# EAGLE board debugger_board (EAGLE 6.6.0), part 1 of 9
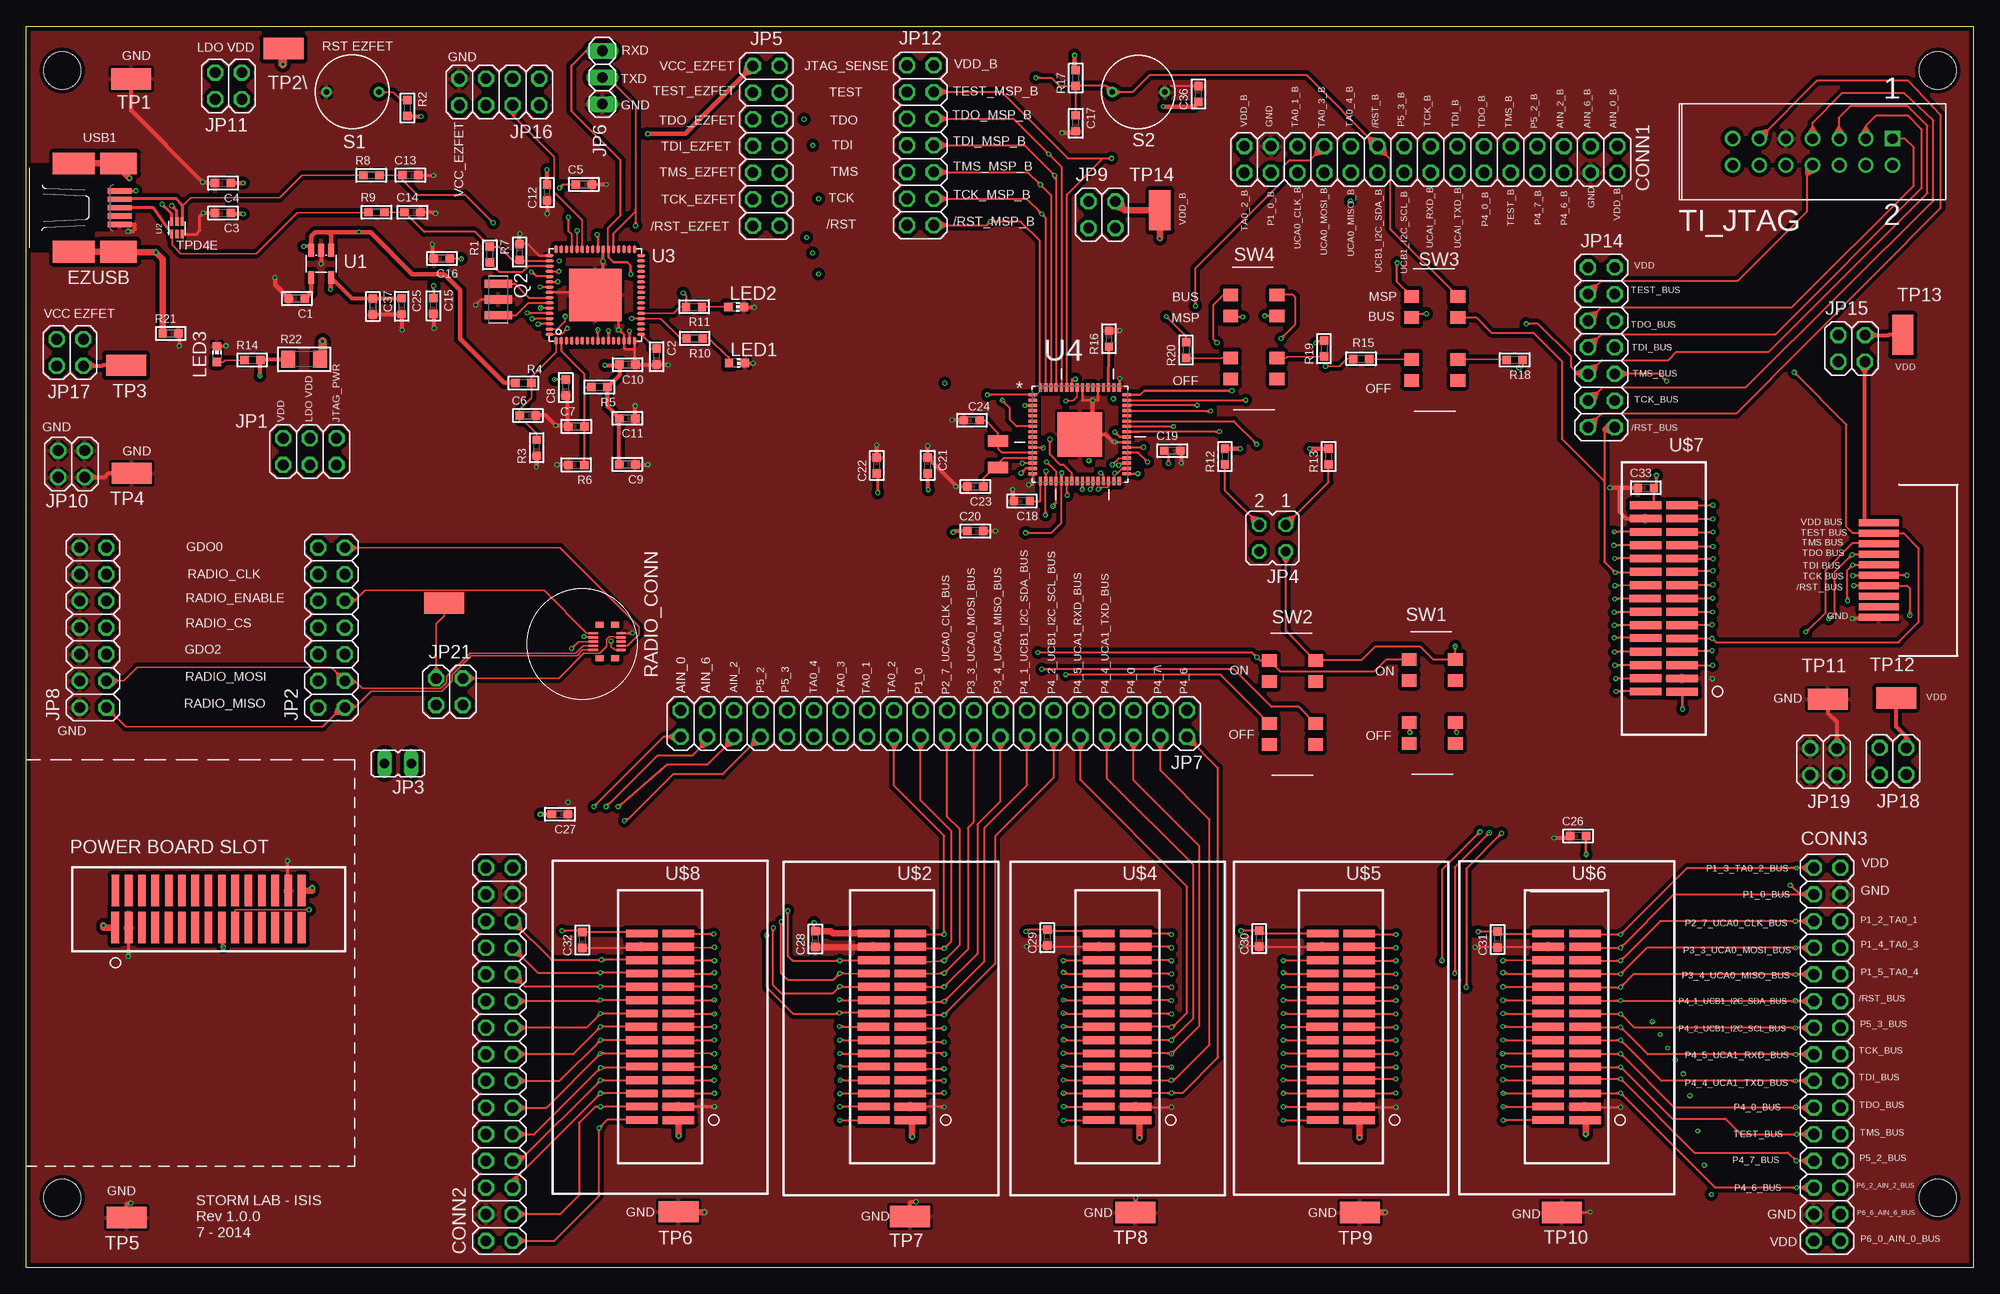
[diagram p5: board, top side]
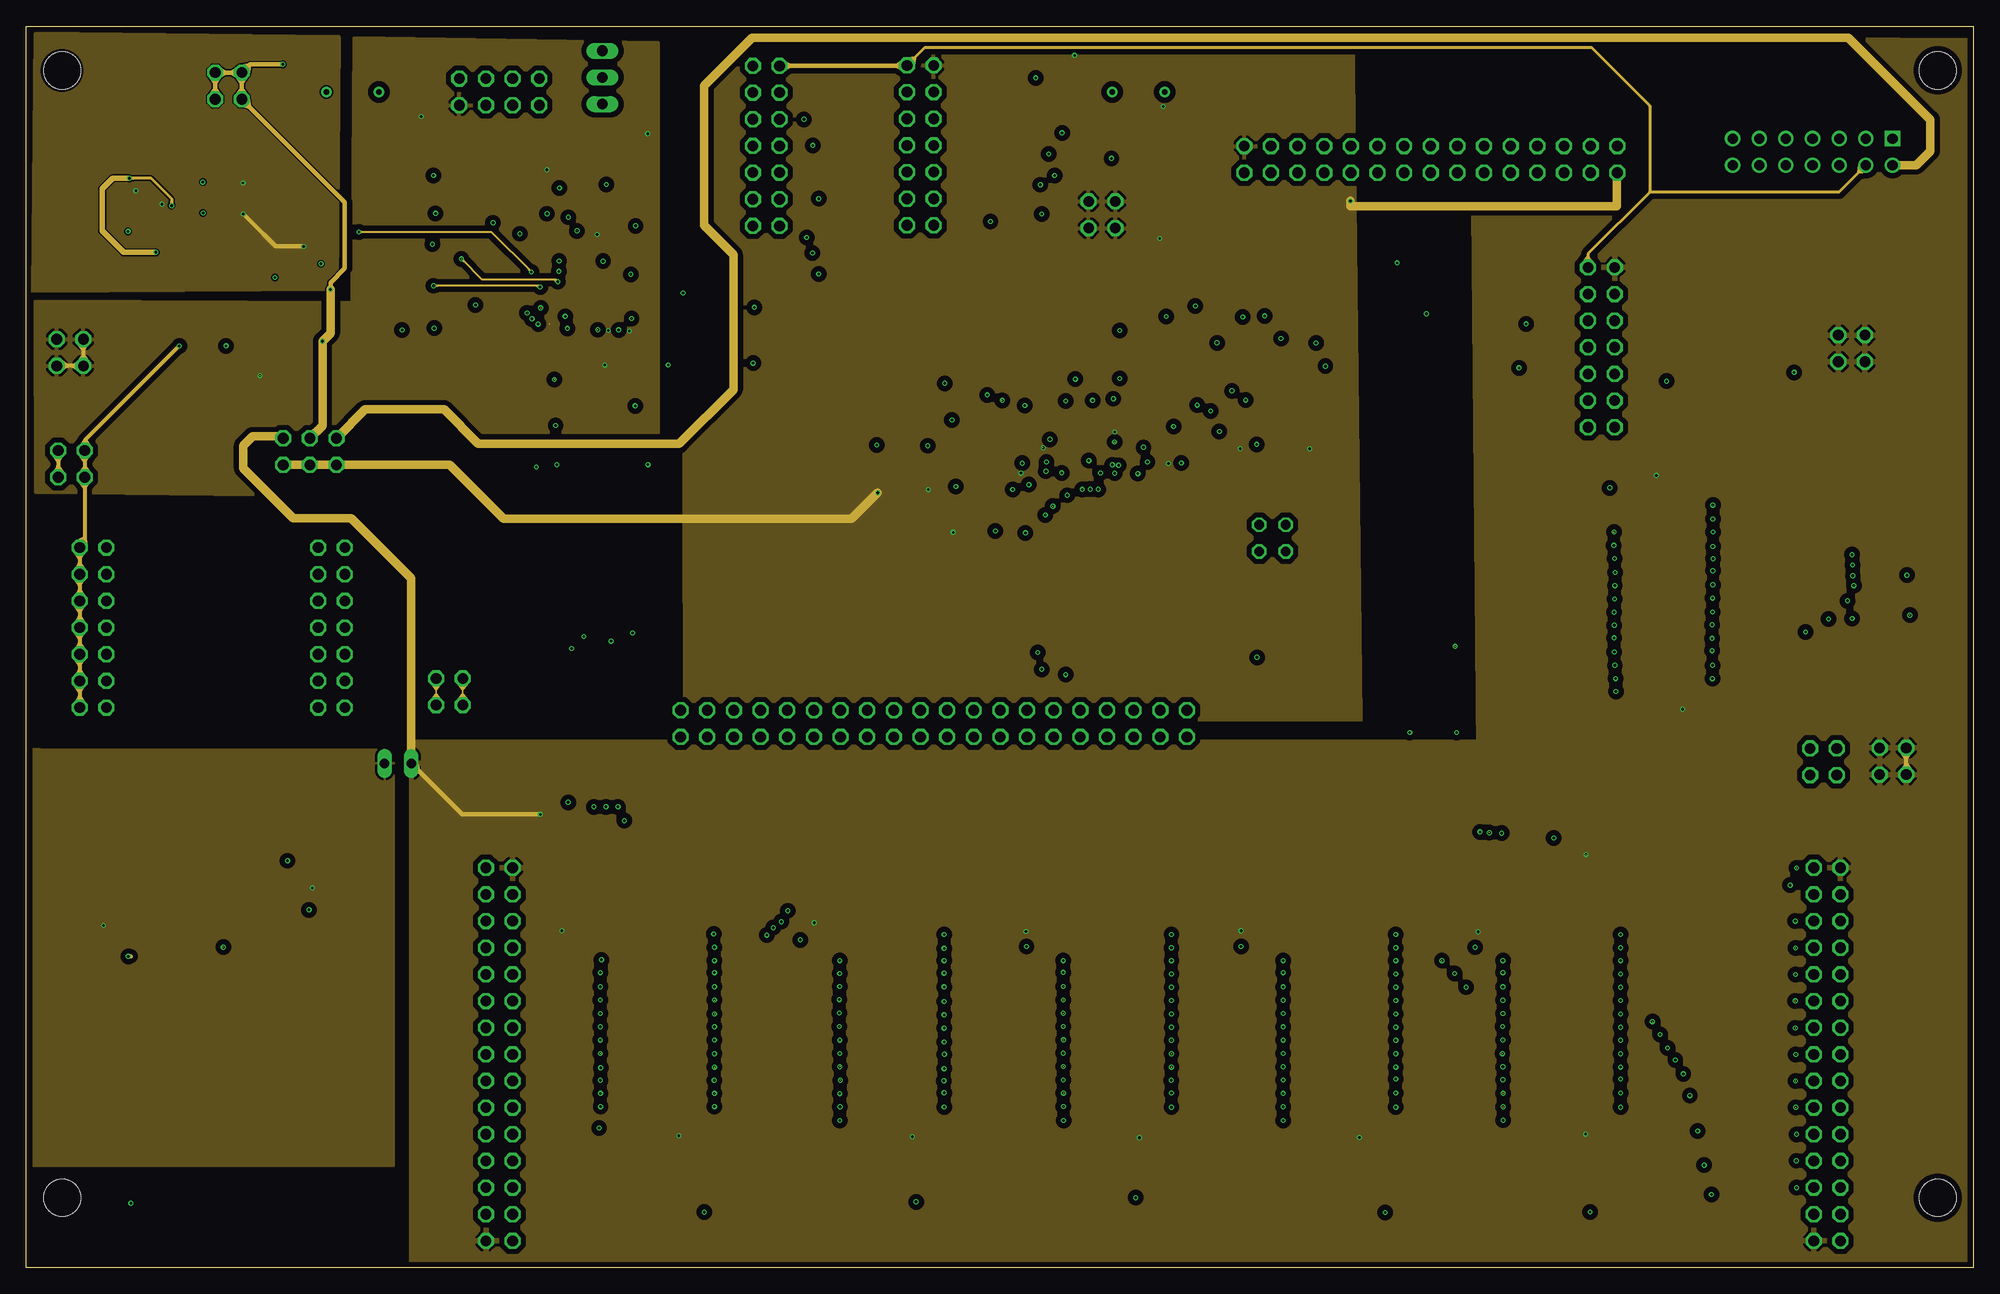
[diagram p6: board, inner layer Route2]
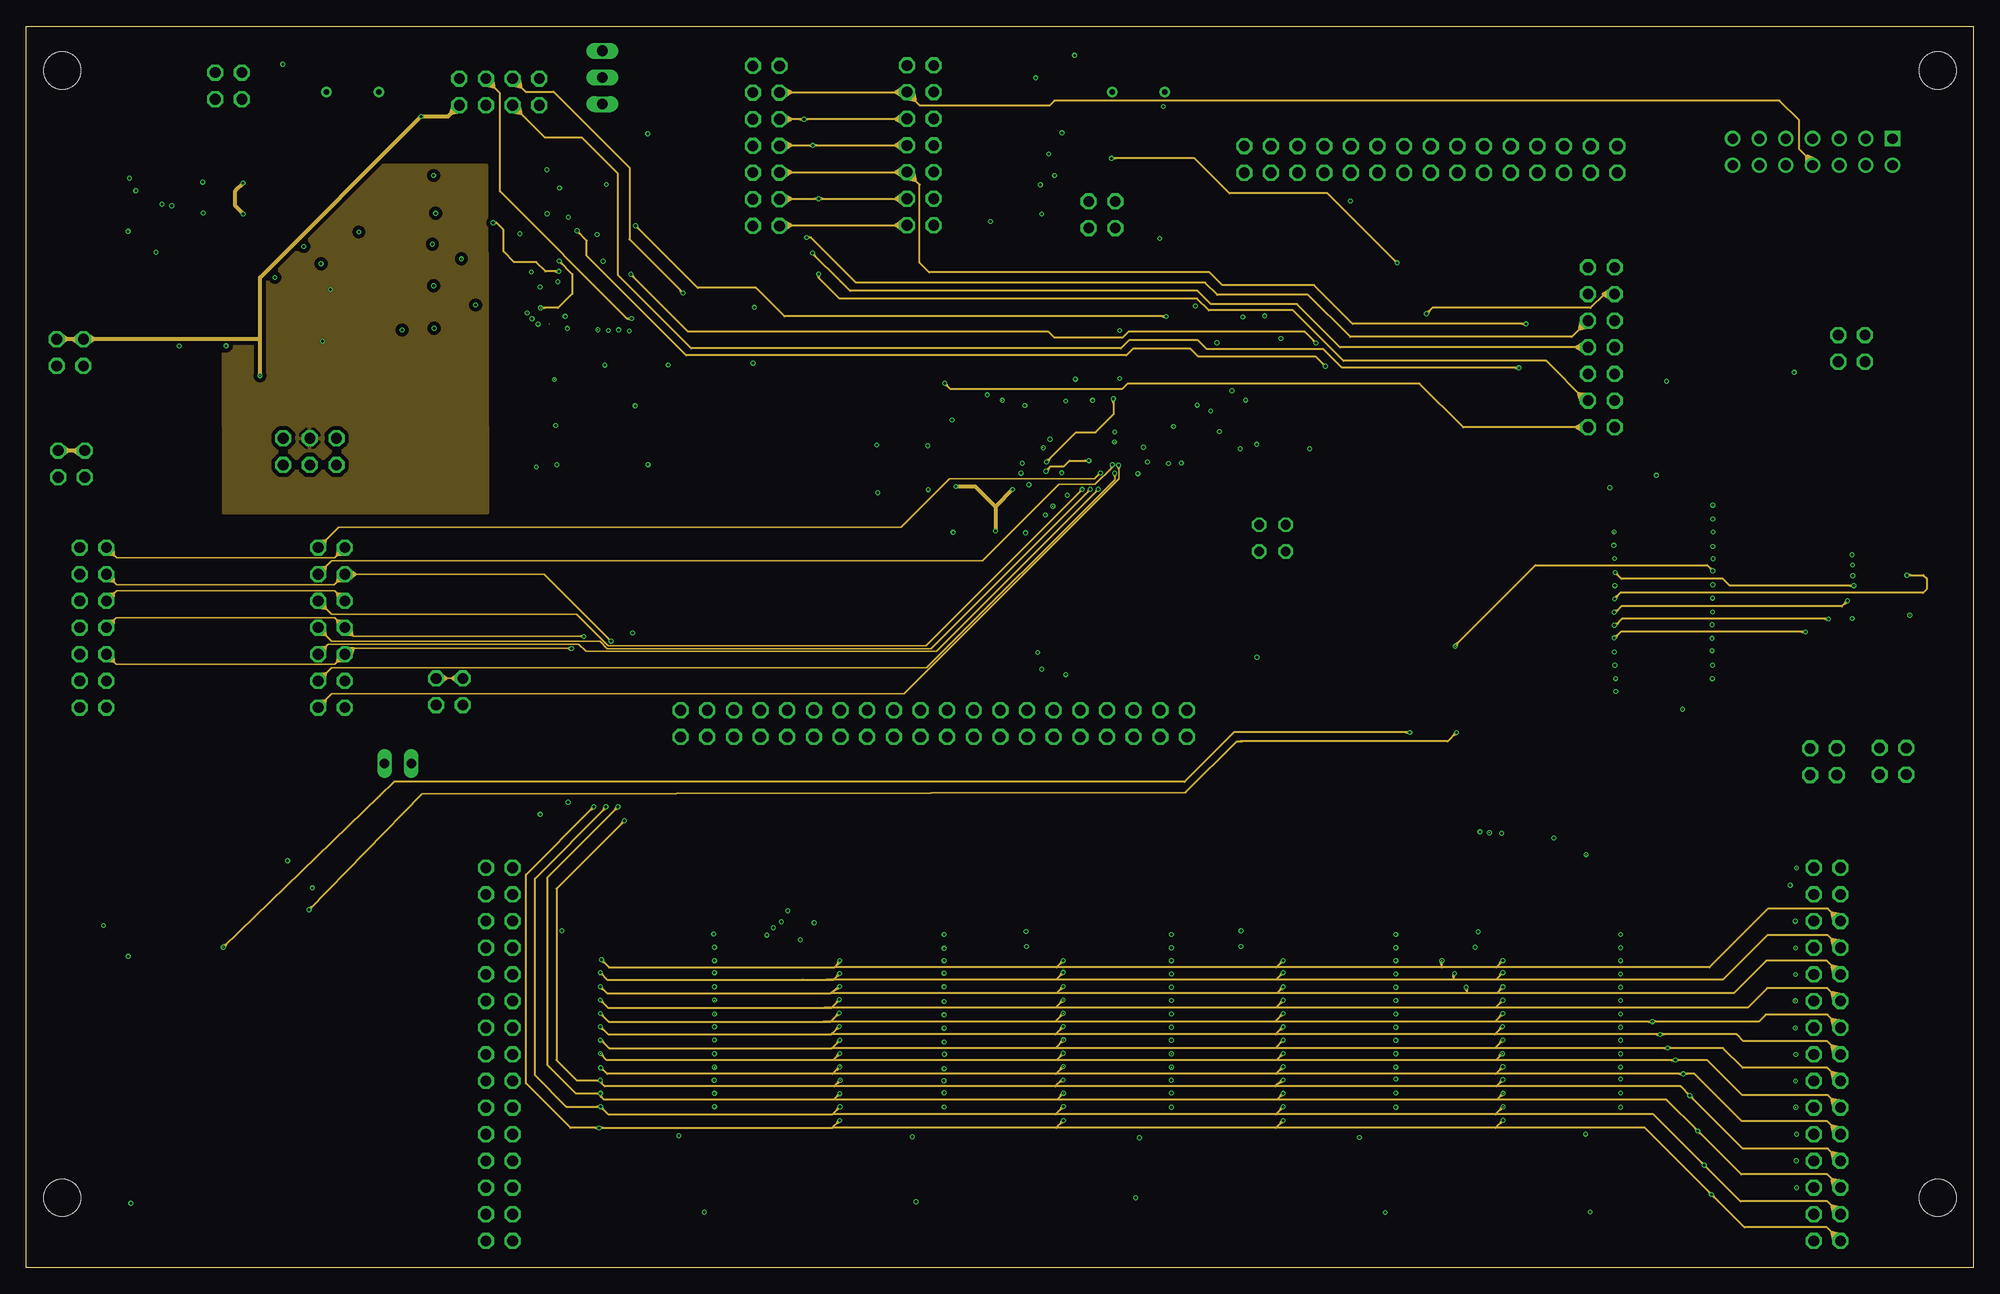
[diagram p7: board, inner layer Route15]
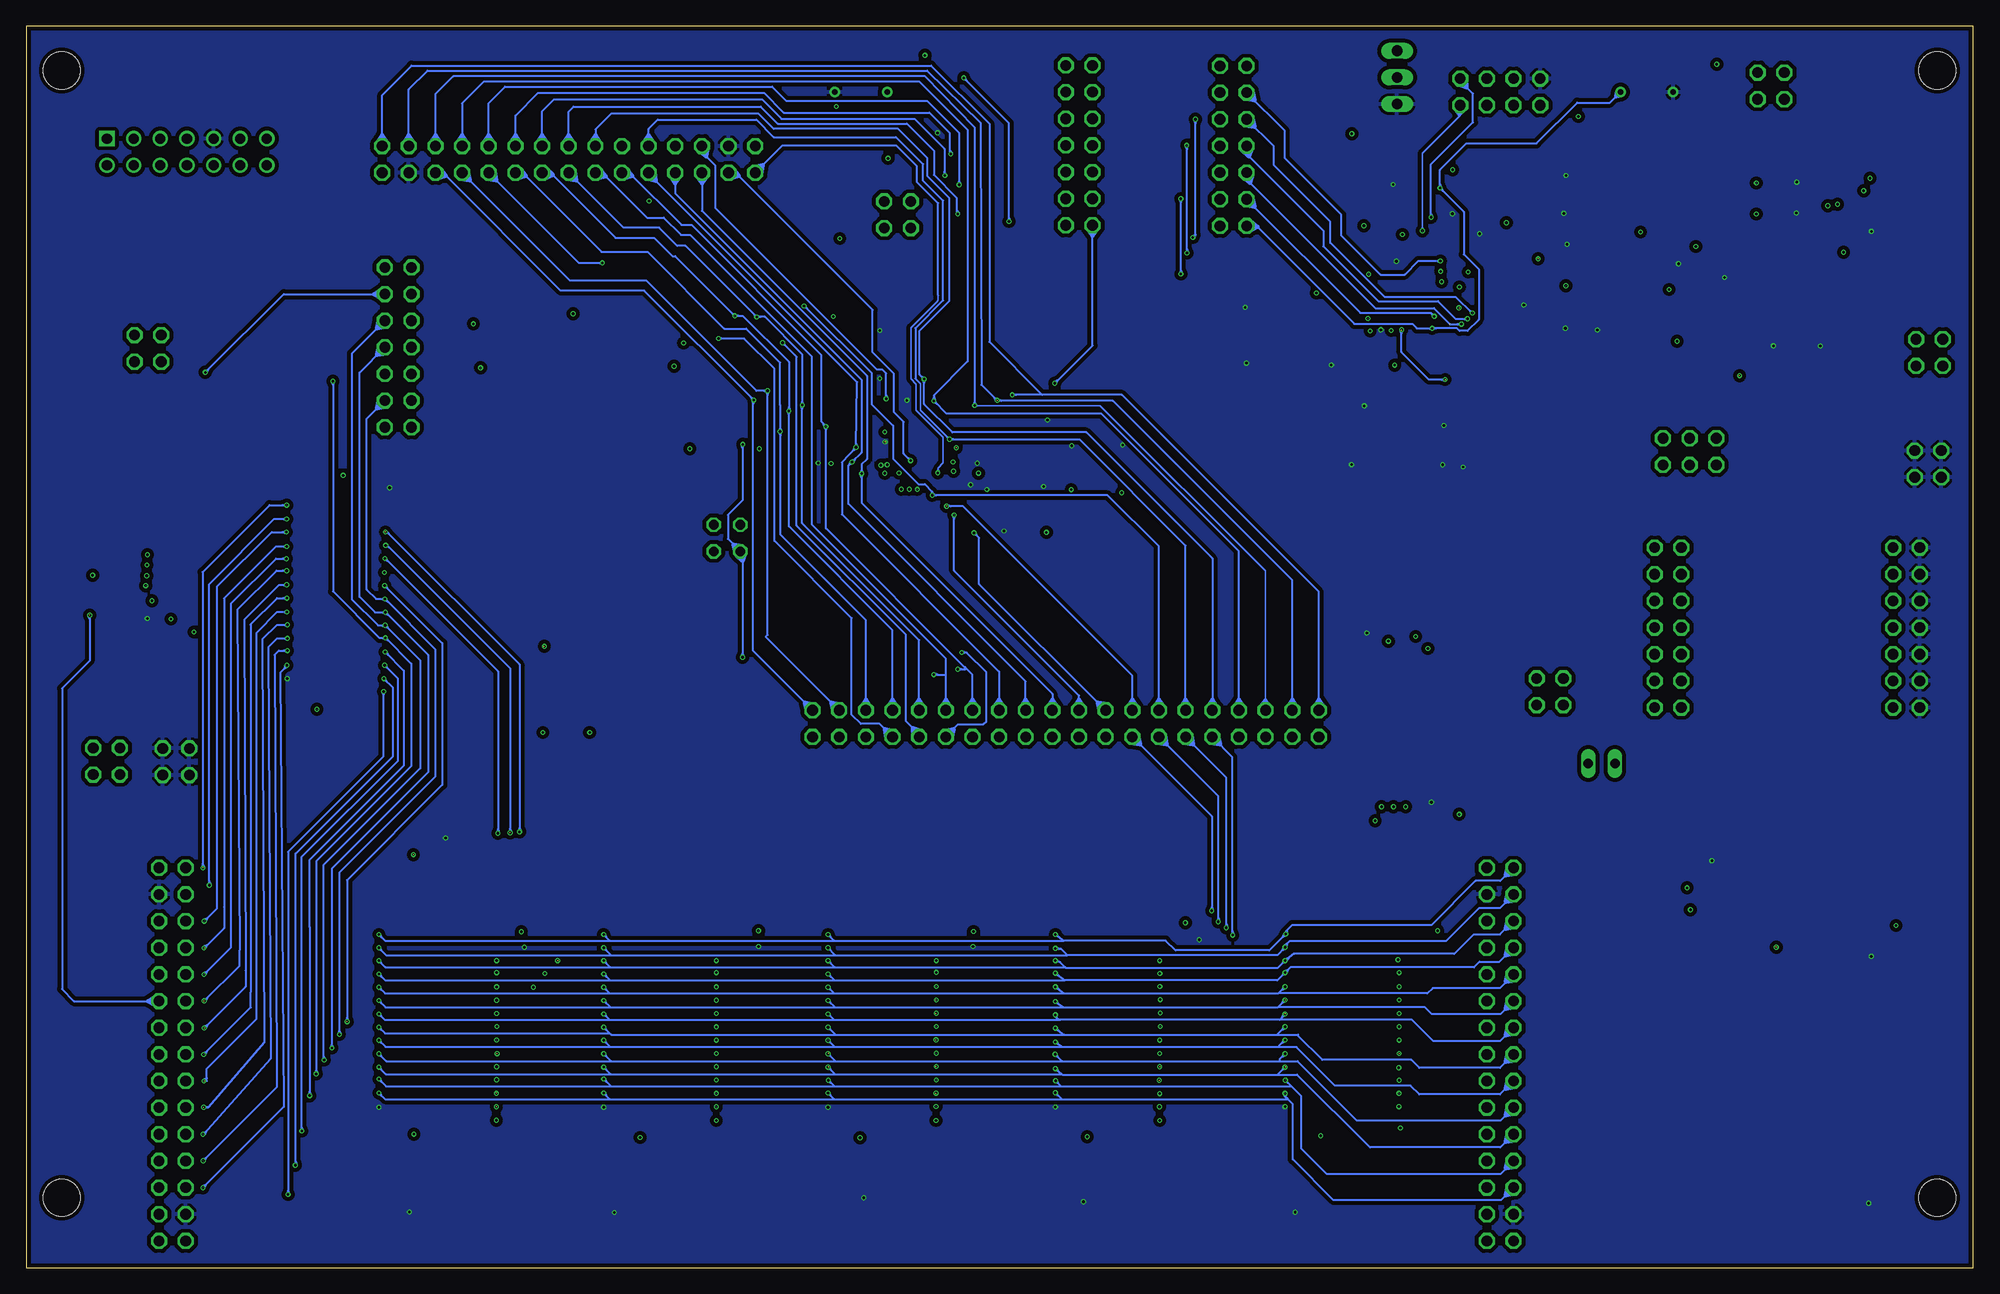
[diagram p8: board, bottom side, seen from below]

Size 185.6 x 118.3 mm. Coordinates in mm from the lower left corner, seen from the top.
Outline: 0,118.3 185.6,118.3 185.6,0 0,0 0,118.3
Copper layers (1+2*15+16): Top 0.0356mm / dielectric 0.1702mm / Route2 0.0178mm / dielectric 47mil / Route15 0.0178mm / dielectric 0.1702mm / Bottom 0.0356mm
Design rules "LaenPCBOrder - 4 layers *": minimum track width 5mil, minimum drill 10mil, track to track 5mil, track to pad 5mil, pad to pad 5mil, via to via 5mil, smd to smd 5mil, copper to edge 10mil, drill to drill 5mil, minimum pad ring 4mil, minimum via ring 4mil, stop-mask expansion 3mil, vias tented up to drill 10mil, thermal gap 10mil
Net classes: 0 default: width 0.127 mm, clearance 0.127 mm; 1 power: width 0.203 mm, clearance 0.127 mm; 2 net: width 0.203 mm, clearance 0.127 mm
Holes 3.55 mm at 3.43,6.66 182.21,6.66 182.21,114.09 3.43,114.09

## Footprints (pad centres in the part's own frame; a part is rotated, then mirrored left to right if it is on the bottom)
C0603 = smd 0.8 x 0.8: 1 -0.762,0; 2 0.762,0
2X15 = drill 1.016 octagon: 1 -17.78,-1.27; 2 -17.78,1.27; 3 -15.24,-1.27; 4 -15.24,1.27; 5 -12.7,-1.27; 6 -12.7,1.27; 7 -10.16,-1.27; 8 -10.16,1.27; 9 -7.62,-1.27; 10 -7.62,1.27; 11 -5.08,-1.27; 12 -5.08,1.27; 13 -2.54,-1.27; 14 -2.54,1.27; 15 0,-1.27; 16 0,1.27; 17 2.54,-1.27; 18 2.54,1.27; 19 5.08,-1.27; 20 5.08,1.27; 21 7.62,-1.27; 22 7.62,1.27; 23 10.16,-1.27; 24 10.16,1.27; 25 12.7,-1.27; 26 12.7,1.27; 27 15.24,-1.27; 28 15.24,1.27; 29 17.78,-1.27; 30 17.78,1.27
UX60A-MB-5ST = smd 2.25 x 0.5: 1 2.25,1.6; 2 2.25,0.8; 3 2.25,0; 4 2.25,-0.8; 5 2.25,-1.6 | smd 4 x 2.05: M1 -2.125,-4.2; M2 -2.125,4.2 | smd 3.5 x 2.05: M3 2.125,4.2; M4 2.125,-4.2
2X03 = drill 1.016 octagon: 1 -2.54,-1.27; 2 -2.54,1.27; 3 0,-1.27; 4 0,1.27; 5 2.54,-1.27; 6 2.54,1.27
2X07 = drill 1.016 octagon: 1 -7.62,-1.27; 2 -7.62,1.27; 3 -5.08,-1.27; 4 -5.08,1.27; 5 -2.54,-1.27; 6 -2.54,1.27; 7 0,-1.27; 8 0,1.27; 9 2.54,-1.27; 10 2.54,1.27; 11 5.08,-1.27; 12 5.08,1.27; 13 7.62,-1.27; 14 7.62,1.27
JP1 = drill 0.914 long: 1 0,-1.27; 2 0,1.27
JP2Q = drill 0.914 octagon: 1 -1.27,-1.27; 2 -1.27,1.27; 3 1.27,-1.27; 4 1.27,1.27
1X03 = drill 1.016 long: 1 -2.54,0; 2 0,0; 3 2.54,0
2X20 = drill 1.016 octagon: 1 -24.13,-1.27; 2 -24.13,1.27; 3 -21.59,-1.27; 4 -21.59,1.27; 5 -19.05,-1.27; 6 -19.05,1.27; 7 -16.51,-1.27; 8 -16.51,1.27; 9 -13.97,-1.27; 10 -13.97,1.27; 11 -11.43,-1.27; 12 -11.43,1.27; 13 -8.89,-1.27; 14 -8.89,1.27; 15 -6.35,-1.27; 16 -6.35,1.27; 17 -3.81,-1.27; 18 -3.81,1.27; 19 -1.27,-1.27; 20 -1.27,1.27; 21 1.27,-1.27; 22 1.27,1.27; 23 3.81,-1.27; 24 3.81,1.27; 25 6.35,-1.27; 26 6.35,1.27; 27 8.89,-1.27; 28 8.89,1.27; 29 11.43,-1.27; 30 11.43,1.27; 31 13.97,-1.27; 32 13.97,1.27; 33 16.51,-1.27; 34 16.51,1.27; 35 19.05,-1.27; 36 19.05,1.27; 37 21.59,-1.27; 38 21.59,1.27; 39 24.13,-1.27; 40 24.13,1.27
2X02 = drill 1.016 octagon: 1 -1.27,-1.27; 2 -1.27,1.27; 3 1.27,-1.27; 4 1.27,1.27
2X04 = drill 1.016 octagon: 1 -3.81,-1.27; 2 -3.81,1.27; 3 -1.27,-1.27; 4 -1.27,1.27; 5 1.27,-1.27; 6 1.27,1.27; 7 3.81,-1.27; 8 3.81,1.27
CHIP-LED0603 = smd 0.8 x 0.8: A 0,-0.75; C 0,0.75
CSTCR6M = smd 0.8 x 2.6: 1 -1.5,0; 2 0,0; 3 1.5,0
R0603 = smd 0.8 x 0.8: 1 -0.762,0; 2 0.762,0
R1206 = smd 1.3 x 1.6: 1 -1.524,0; 2 1.524,0
559099872_2X5_PLUG = smd 0.9 x 0.22: P$1 -1.315,0.8; P$2 -1.315,0.4; P$3 -1.315,0; P$4 -1.315,-0.4; P$5 -1.315,-0.8; P$6 1.315,-0.8; P$7 1.315,-0.4; P$8 1.315,0; P$9 1.315,0.4; P$10 1.315,0.8 | smd 0.8 x 0.55: P$11 -0.74,1.6; P$12 0.74,1.6; P$13 -0.74,-1.6; P$14 0.74,-1.6
EVQ_11_TH = drill 0.55 pad 1.016: P$1 -2.5,0; P$2 2.5,0
CL-SB-23B-02 = smd 1.2 x 1.4: P$1 -4,-2.2; P$2 -2,-2.2; P$3 2,-2.2; P$4 4,-2.2; P$5 -4,2.2; P$6 -2,2.2; P$7 2,2.2; P$8 4,2.2
5019_PAD = smd 3.81 x 2.032: P$1 0,0
TYCO_5103308-2 = drill 0.965 square: 1 0,2.54 | drill 0.965: 2 0,0; 3 -2.54,2.54; 4 -2.54,0; 5 -5.08,2.54; 6 -5.08,0; 7 -7.62,2.54; 8 -7.62,0; 9 -10.16,2.54; 10 -10.16,0; 11 -12.7,2.54; 12 -12.7,0; 13 -15.24,2.54; 14 -15.24,0
SOT23 = smd 0.55 x 1.2: 1 -0.95,-1.3; 2 0,-1.3; 3 0.95,-1.3; 4 0.95,1.3; 5 -0.95,1.3
SON(DRY)6 = smd 0.81 x 0.305: 1 -0.1,0; 2 -0.1,-0.5; 3 -0.1,-1; 4 1.1,-1; 5 1.1,-0.5; 6 1.1,0
RGC64 = smd 0.825 x 0.28: 1 -4.36,3.75; 2 -4.36,3.25; 3 -4.36,2.75; 4 -4.36,2.25; 5 -4.36,1.75; 6 -4.36,1.25; 7 -4.36,0.75; 8 -4.36,0.25; 9 -4.36,-0.25; 10 -4.36,-0.75; 11 -4.36,-1.25; 12 -4.36,-1.75; 13 -4.36,-2.25; 14 -4.36,-2.75; 15 -4.36,-3.25; 16 -4.36,-3.75; 33 4.36,-3.75; 34 4.36,-3.25; 35 4.36,-2.75; 36 4.36,-2.25; 37 4.36,-1.75; 38 4.36,-1.25; 39 4.36,-0.75; 40 4.36,-0.25; 41 4.36,0.25; 42 4.36,0.75; 43 4.36,1.25; 44 4.36,1.75; 45 4.36,2.25; 46 4.36,2.75; 47 4.36,3.25; 48 4.36,3.75 | smd 0.28 x 0.825: 17 -3.75,-4.36; 18 -3.25,-4.36; 19 -2.75,-4.36; 20 -2.25,-4.36; 21 -1.75,-4.36; 22 -1.25,-4.36; 23 -0.75,-4.36; 24 -0.25,-4.36; 25 0.25,-4.36; 26 0.75,-4.36; 27 1.25,-4.36; 28 1.75,-4.36; 29 2.25,-4.36; 30 2.75,-4.36; 31 3.25,-4.36; 32 3.75,-4.36; 49 3.75,4.36; 50 3.25,4.36; 51 2.75,4.36; 52 2.25,4.36; 53 1.75,4.36; 54 1.25,4.36; 55 0.75,4.36; 56 0.25,4.36; 57 -0.25,4.36; 58 -0.75,4.36; 59 -1.25,4.36; 60 -1.75,4.36; 61 -2.25,4.36; 62 -2.75,4.36; 63 -3.25,4.36; 64 -3.75,4.36 | smd 5 x 5: TP 0,0
QFN50P900X900X100-65N = smd 0.813 x 0.305: 1 -4.47,3.759; 2 -4.47,3.251; 3 -4.47,2.743; 4 -4.47,2.261; 5 -4.47,1.753; 6 -4.47,1.245; 7 -4.47,0.762; 8 -4.47,0.254; 9 -4.47,-0.254; 10 -4.47,-0.762; 11 -4.47,-1.245; 12 -4.47,-1.753; 13 -4.47,-2.261; 14 -4.47,-2.743; 15 -4.47,-3.251; 16 -4.47,-3.759; 33 4.47,-3.759; 34 4.47,-3.251; 35 4.47,-2.743; 36 4.47,-2.261; 37 4.47,-1.753; 38 4.47,-1.245; 39 4.47,-0.762; 40 4.47,-0.254; 41 4.47,0.254; 42 4.47,0.762; 43 4.47,1.245; 44 4.47,1.753; 45 4.47,2.261; 46 4.47,2.743; 47 4.47,3.251; 48 4.47,3.759 | smd 0.305 x 0.813: 17 -3.759,-4.47; 18 -3.251,-4.47; 19 -2.743,-4.47; 20 -2.261,-4.47; 21 -1.753,-4.47; 22 -1.245,-4.47; 23 -0.762,-4.47; 24 -0.254,-4.47; 25 0.254,-4.47; 26 0.762,-4.47; 27 1.245,-4.47; 28 1.753,-4.47; 29 2.261,-4.47; 30 2.743,-4.47; 31 3.251,-4.47; 32 3.759,-4.47; 49 3.759,4.47; 50 3.251,4.47; 51 2.743,4.47; 52 2.261,4.47; 53 1.753,4.47; 54 1.245,4.47; 55 0.762,4.47; 56 0.254,4.47; 57 -0.254,4.47; 58 -0.762,4.47; 59 -1.245,4.47; 60 -1.753,4.47; 61 -2.261,4.47; 62 -2.743,4.47; 63 -3.251,4.47; 64 -3.759,4.47 | smd 4.242 x 4.242: 65 0,0
TFML-115-02-S-D = smd 3 x 0.74: P$1 -1.755,8.89; P$2 -1.755,7.62; P$3 -1.755,6.35; P$4 -1.755,5.08; P$5 -1.755,3.81; P$6 -1.755,2.54; P$7 -1.755,1.27; P$8 -1.755,0; P$9 -1.755,-1.27; P$10 -1.755,-2.54; P$11 -1.755,-3.81; P$12 -1.755,-5.08; P$13 -1.755,-6.35; P$14 -1.755,-7.62; P$15 -1.755,-8.89; P$16 1.755,-8.89; P$17 1.755,-7.62; P$18 1.755,-6.35; P$19 1.755,-5.08; P$20 1.755,-3.81; P$21 1.755,-2.54; P$22 1.755,-1.27; P$23 1.775,0; P$24 1.755,1.27; P$25 1.755,2.54; P$26 1.755,3.77; P$27 1.755,5.08; P$28 1.755,6.35; P$29 1.755,7.6; P$30 1.755,8.87
FPC_FFC = smd 3.8 x 0.7: P$1 0,4.5; P$2 0,3.5; P$3 0,2.5; P$4 0,1.5; P$5 0,0.5; P$6 0,-0.5; P$7 0,-1.5; P$8 0,-2.5; P$9 0,-3.5; P$10 0,-4.5
ABS07 = smd 1.1 x 1.9: P$1 -1.25,0; P$2 1.25,0

## Placement (x,y rotation side)
C1  10n  [C0603]  25.8,92.34 180 top
C2  470n  [C0603]  60.09,86.81 270 top
C3  100n  [C0603]  18.75,100.49 180 top
C4  10u  [C0603]  18.76,103.35 180 top
C5  1n  [C0603]  53.16,103.23 0 top
C6  33p  [C0603]  47.81,81.2 0 top
C7  33p  [C0603]  52.43,80.17 0 top
C8  100n  [C0603]  51.42,83.87 90 top
C9  100n  [C0603]  57.29,76.54 180 top
C10  100n  [C0603]  57.32,86.05 180 top
C11  10u  [C0603]  57.3,80.94 180 top
C12  100n  [C0603]  49.65,102.45 90 top
C13  10p  [C0603]  36.62,104.11 0 top
C14  10p  [C0603]  36.82,100.58 0 top
C15  220n  [C0603]  38.83,91.65 270 top
C16  220n  [C0603]  39.64,96.16 180 top
C17  10n  [C0603]  100.05,109.05 270 top
C18  470n  [C0603]  94.92,73.05 180 top
C19  100n  [C0603]  109.25,77.84 0 top
C20  100n  [C0603]  90.47,70.19 0 top
C21  100n  [C0603]  85.93,76.45 270 top
C22  10u  [C0603]  81.09,76.43 90 top
C23  12p  [C0603]  90.48,74.44 180 top
C24  12p  [C0603]  90.15,80.75 180 top
C25  10u  [C0603]  35.79,91.61 270 top
C26  100n  [C0603]  147.92,41.12 0 top
C27  100n  [C0603]  50.88,43.2 180 top
C28  100n  [C0603]  75.22,31.31 90 top
C29  100n  [C0603]  97.32,31.45 90 top
C30  100n  [C0603]  117.54,31.35 90 top
C31  100n  [C0603]  140.25,31.26 90 top
C32  100n  [C0603]  53,31.23 90 top
C33  100n  [C0603]  154.39,74.31 0 top
C36  100n  [C0603]  111.74,111.85 90 top
C37  100n  [C0603]  33.04,91.58 270 top
CONN1  HEADER MSP430_B  [2X15]  133.89,105.6 180 top
CONN2  HEADER BUS A  [2X15]  45.1,20.32 90 top
CONN3  HEADER BUS B  [2X15]  171.66,20.32 90 top
EZUSB  USB!  [UX60A-MB-5ST]  6.66,101.01 0 top
JP1  VDD B SEL  [2X03]  27.04,77.76 180 top
JP2  RADIO_HEADER B  [2X07]  29.09,60.99 90 top
JP3  POW BOARD POWER  [JP1]  35.43,48.05 90 top
JP4  I2C PULL UP  [JP2Q]  118.8,69.52 180 top
JP5  JPR_EZFET_JTAG  [2X07]  70.53,106.89 270 top
JP6  EZFET_UART  [1X03]  54.92,113.42 270 top
JP7  JUMPER HEADER MSB_B <_> GLOBAL BUS  [2X20]  86.51,51.84 180 top
JP8  RADIO SPI  [2X07]  6.37,60.99 90 top
JP9  VDD_B  [2X02]  102.54,100.34 0 top
JP10  GND  [2X02]  4.31,76.59 0 top
JP11  LDO_VDD  [2X02]  19.28,112.62 180 top
JP12  JPR_MSP_B_JTAG  [2X07]  85.23,106.95 270 top
JP14  GLOBAL BUS JUMPER JTAG  [2X07]  150.14,87.7 270 top
JP15  VDD  [2X02]  174.01,87.59 0 top
JP16  EZFET_HEADER  [2X04]  45.09,112.04 180 top
JP17  VCC_EZFET  [2X02]  4.18,87.2 0 top
JP18  VDD  [2X02]  177.94,48.25 180 top
JP19  GND  [2X02]  171.32,48.21 180 top
JP21  VDD_RADIO  [2X02]  40.34,54.88 0 top
LED1  red  [CHIP-LED0603]  67.75,86.19 270 top
LED2  green  [CHIP-LED0603]  67.68,91.56 270 top
LED3  [CHIP-LED0603]  18.17,87.05 0 top
Q2  OSC  [CSTCR6M]  45.01,92.26 270 top
R1  1k4  [R0603]  44.19,96.53 270 top
R2  47k  [R0603]  36.33,110.51 270 top
R3  150k  [R0603]  48.65,78.13 90 top
R4  240k  [R0603]  47.4,84.31 0 top
R5  220k  [R0603]  54.64,83.91 180 top
R6  220k  [R0603]  52.42,76.49 180 top
R7  1M  [R0603]  47.04,96.79 90 top
R8  27  [R0603]  32.89,104.1 0 top
R9  27  [R0603]  33.39,100.58 0 top
R10  470  [R0603]  63.71,88.56 180 top
R11  390  [R0603]  63.67,91.56 180 top
R12  4.7k  [R0603]  114.27,77.3 90 top
R13  4.7k  [R0603]  124.14,77.29 90 top
R14  470  [R0603]  21.55,86.49 0 top
R15  10  [R0603]  127.25,86.61 180 top
R16  1M  [R0603]  103.21,88.52 90 top
R17  47k  [R0603]  100.04,113.37 90 top
R18  10  [R0603]  141.89,86.51 180 top
R19  10  [R0603]  123.71,87.58 90 top
R20  10  [R0603]  110.56,87.44 90 top
R21  33k  [R0603]  13.77,89.02 0 top
R22  0  [R1206]  26.5,86.56 0 top
RADIO_CONN  RADIO  [559099872_2X5_PLUG]  55.39,59.66 180 top
S1  RST_EZFET  [EVQ_11_TH]  31.12,112.03 0 top
S2  RST_MSP_B  [EVQ_11_TH]  106.03,112.02 0 top
SW1  I2C POW SW > BUS  [CL-SB-23B-02]  134.03,53.96 270 top
SW2  I2C MSP_B > BUS  [CL-SB-23B-02]  120.7,53.85 270 top
SW3  JTAG SWITCH  [CL-SB-23B-02]  134.27,88.55 270 top
SW4  UART SWITCH  [CL-SB-23B-02]  117.02,88.69 270 top
TEST  VDD_RADIO  [5019_PAD]  39.82,63.33 0 top
TI_JTAG  TI_JTAG  [TYCO_5103308-2]  177.9,105.05 0 top
TP1  GND  [5019_PAD]  10,113.28 180 top
TP2\  LDO VDD  [5019_PAD]  24.52,116.16 0 top
TP3  VCC_EZFET  [5019_PAD]  9.51,85.99 0 top
TP4  GND  [5019_PAD]  10.05,75.69 0 top
TP5  TEST_POINT  [5019_PAD]  9.59,4.76 0 top
TP6  TP6  [5019_PAD]  62.19,5.31 0 top
TP7  GND  [5019_PAD]  84.26,4.88 0 top
TP8  GND  [5019_PAD]  105.76,5.24 0 top
TP9  GND  [5019_PAD]  127.11,5.24 0 top
TP10  GND  [5019_PAD]  146.37,5.24 0 top
TP11  GND  [5019_PAD]  171.75,54.17 0 top
TP12  VDD  [5019_PAD]  178.26,54.27 0 top
TP13  VDD  [5019_PAD]  178.88,88.88 90 top
TP14  VDD_B  [5019_PAD]  108.06,100.75 270 top
U1  TPS73233  [SOT23]  28.11,95.65 180 top
U2  TPD4E  [SON(DRY)6]  13.88,98.6 90 top
U3  USB_EZFET  [RGC64]  54.24,92.69 90 top
U4  MSP430_B  [QFN50P900X900X100-65N]  100.43,79.41 0 top
U$2  SLOT2  [TFML-115-02-S-D]  82.54,22.94 180 top
U$4  SLOT3  [TFML-115-02-S-D]  104,22.94 180 top
U$5  SLOT4  [TFML-115-02-S-D]  125.33,22.94 180 top
U$6  SLOT5  [TFML-115-02-S-D]  146.83,22.94 180 top
U$7  TFML-115-02-S-D  [TFML-115-02-S-D]  156.11,63.76 180 top
U$8  SLOT1  [TFML-115-02-S-D]  60.42,22.94 180 top
U$9  POWER BOARD SLOT  [TFML-115-02-S-D]  17.38,34.16 90 top
U$10  FPC_CABLE_ADAPTATOR  [FPC_FFC]  176.59,66.48 180 top
U$16  OSC32K  [ABS07]  92.64,77.51 270 top

## Tracks (layer width: path | path; a pad name or v marks a point on that pad's centre or on a via)
/RST  (via drill 0.25 pad 0.46)
  Top 0.203: JP14.13 150.19,81.4 163.05,81.4 182.48,100.99 182.48,109.79 179.41,113.1 170.71,113.1 TI_JTAG.11
  Top 0.406: 165.88,108.28 165.09,108.1 TI_JTAG.11 165.71,107.48 165.88,108.28 | 149.59,80.8 148.76,80.63 JP14.13 149.42,79.97 149.59,80.8
  Route15 0.203: JP5.14 71.86,99.33 JP12.13 | JP14.13 136.98,80.08 132.81,84.25 104.97,84.25 104.44,83.71 88.11,83.71 v87.55,84.27 | 87.82,84 87.66,84.33 | v87.55,84.27 87.66,84.33 | 87.82,84 87.5,84.16 | v87.55,84.27 87.5,84.16 | 87.82,84 87.66,84.33 | v87.55,84.27 87.66,84.33 | 87.82,84 87.5,84.16 | v87.55,84.27 87.5,84.16 | 87.82,84 87.66,84.33 | v87.55,84.27 87.66,84.33 | 87.82,84 87.5,84.16 | v87.55,84.27 87.5,84.16 | 87.82,84 87.66,84.33 | v87.55,84.27 87.66,84.33 | 87.82,84 87.5,84.16 | v87.55,84.27 87.5,84.16
  Route15 0.406: 82.94,99.33 83.65,98.86 JP12.13 83.65,99.79 82.94,99.33 | 147.86,80.08 148.57,79.61 JP14.13 148.57,80.55 147.86,80.08 | 72.82,99.33 72.09,99.75 JP5.14 72.14,98.82 72.82,99.33
  Bottom 0.203: v87.55,84.27 83.96,87.87 JP12.13 | 87.28,84.54 87.44,84.22 | v87.55,84.27 87.44,84.22 | 87.28,84.54 87.61,84.38 | v87.55,84.27 87.61,84.38 | 87.28,84.54 87.44,84.22 | v87.55,84.27 87.44,84.22 | 87.28,84.54 87.61,84.38 | v87.55,84.27 87.61,84.38 | 87.28,84.54 87.44,84.22 | v87.55,84.27 87.44,84.22 | 87.28,84.54 87.61,84.38 | v87.55,84.27 87.61,84.38 | 87.28,84.54 87.44,84.22 | v87.55,84.27 87.44,84.22 | 87.28,84.54 87.61,84.38 | v87.55,84.27 87.61,84.38
  Bottom 0.406: 83.96,98.31 84.42,99.02 JP12.13 83.49,99.02 83.96,98.31
/RST_B  (via drill 0.25 pad 0.46)
  Top 0.203: 136.52,92.58 136.49,92.55 SW3.P$5 130.05,98.97 130.05,105.64 CONN1.19 122.07,113.61 107.06,113.61 105.47,112.02 S2.P$1 102.94,112.61 R17.1 | C17.1 100.05,112.6 R17.1 | U4.64 96.62,83.94 96.62,97.83 94.76,99.69 v91.92,99.69 | v96.24,113.38 97.71,113.38 98.47,112.62 R17.1 | JP12.14 91.56,99.33 v91.92,99.69 | 92.3,99.69 91.96,99.81 | v91.92,99.69 91.96,99.81 | 92.3,99.69 91.96,99.57 | v91.92,99.69 91.96,99.57 | 91.65,99.42 91.97,99.57 | v91.92,99.69 91.97,99.57 | 91.65,99.42 91.8,99.74 | v91.92,99.69 91.8,99.74 | 96.62,113.38 96.28,113.5 | v96.24,113.38 96.28,113.5 | 96.62,113.38 96.28,113.26 | v96.24,113.38 96.28,113.26 | 92.3,99.69 91.96,99.81 | v91.92,99.69 91.96,99.81 | 92.3,99.69 91.96,99.57 | v91.92,99.69 91.96,99.57 | 91.65,99.42 91.97,99.57 | v91.92,99.69 91.97,99.57 | 91.65,99.42 91.8,99.74 | v91.92,99.69 91.8,99.74 | 92.3,99.69 91.96,99.81 | v91.92,99.69 91.96,99.81 | 92.3,99.69 91.96,99.57 | v91.92,99.69 91.96,99.57 | 92.3,99.69 91.96,99.81 | v91.92,99.69 91.96,99.81 | 92.3,99.69 91.96,99.57 | v91.92,99.69 91.96,99.57 | 91.65,99.42 91.97,99.57 | v91.92,99.69 91.97,99.57 | 91.65,99.42 91.8,99.74 | v91.92,99.69 91.8,99.74 | 91.65,99.42 91.97,99.57 | v91.92,99.69 91.97,99.57 | 91.65,99.42 91.8,99.74 | v91.92,99.69 91.8,99.74 | 96.62,113.38 96.28,113.5 | v96.24,113.38 96.28,113.5 | 96.62,113.38 96.28,113.26 | v96.24,113.38 96.28,113.26 | 96.62,113.38 96.28,113.5 | v96.24,113.38 96.28,113.5 | 96.62,113.38 96.28,113.26 | v96.24,113.38 96.28,113.26 | 96.62,113.38 96.28,113.5 | v96.24,113.38 96.28,113.5 | 96.62,113.38 96.28,113.26 | v96.24,113.38 96.28,113.26
  Top 0.406: S2.P$1 103.23,111.96 103.14,112.41 103.59,112.32 S2.P$1 | S2.P$1 103.7,112.28 104.08,112.02 103.7,111.77 S2.P$1 | CONN1.19 128.26,106.76 128.09,107.59 128.92,107.42 CONN1.19 | CONN1.19 129.36,106.98 129.53,106.15 128.7,106.32 CONN1.19 | 87.51,99.33 86.8,99.79 JP12.14 86.8,98.86 87.51,99.33
  Bottom 0.203: v91.92,99.69 91.92,109.06 v96.24,113.38 | 91.92,100.07 91.8,99.73 | v91.92,99.69 91.8,99.73 | 91.92,100.07 92.04,99.73 | v91.92,99.69 92.04,99.73 | 95.97,113.11 96.29,113.26 | v96.24,113.38 96.29,113.26 | 95.97,113.11 96.12,113.43 | v96.24,113.38 96.12,113.43 | 91.92,100.07 91.8,99.73 | v91.92,99.69 91.8,99.73 | 91.92,100.07 92.04,99.73 | v91.92,99.69 92.04,99.73 | 91.92,100.07 91.8,99.73 | v91.92,99.69 91.8,99.73 | 91.92,100.07 92.04,99.73 | v91.92,99.69 92.04,99.73 | 91.92,100.07 91.8,99.73 | v91.92,99.69 91.8,99.73 | 91.92,100.07 92.04,99.73 | v91.92,99.69 92.04,99.73 | 95.97,113.11 96.29,113.26 | v96.24,113.38 96.29,113.26 | 95.97,113.11 96.12,113.43 | v96.24,113.38 96.12,113.43 | 95.97,113.11 96.29,113.26 | v96.24,113.38 96.29,113.26 | 95.97,113.11 96.12,113.43 | v96.24,113.38 96.12,113.43 | 95.97,113.11 96.29,113.26 | v96.24,113.38 96.29,113.26 | 95.97,113.11 96.12,113.43 | v96.24,113.38 96.12,113.43
/RST_BUS  (via drill 0.25 pad 0.46)  (3 unrouted)
  Top 0.203: SW3.P$6 138.22,90.55 139.66,89.1 143.66,89.1 146.38,86.38 146.38,78.99 150.42,74.95 | JP14.14 150.42,80.08 150.42,74.95 | v54.73,25.5 54.67,25.4 CONN2.19 | U$8.P$21 v54.73,25.5 | v77.51,25.53 77.56,25.48 U$2.P$21 | 98.88,25.48 U$4.P$21 | v119.81,25.48 U$5.P$21 | v140.76,25.48 U$6.P$21 | U$7.P$21 154.29,66.24 v151.46,66.24 | 179.52,62.2 179.52,64.76 179.31,64.98 U$10.P$4 v174.23,64.98 | 150.42,74.95 150.42,67.27 v151.46,66.24 | 77.89,25.48 77.57,25.65 | v77.51,25.53 77.57,25.65 | 77.89,25.48 77.54,25.41 | v77.51,25.53 77.54,25.41 | 54.36,25.4 54.72,25.37 | v54.73,25.5 54.72,25.37 | 54.36,25.4 54.66,25.6 | v54.73,25.5 54.66,25.6 | 55.11,25.49 54.78,25.61 | v54.73,25.5 54.78,25.61 | 55.11,25.49 54.78,25.38 | v54.73,25.5 54.78,25.38 | 99.23,25.48 98.9,25.62 | v98.85,25.51 98.9,25.62 | 99.23,25.48 98.89,25.39 | v98.85,25.51 98.89,25.39 | 120.19,25.48 119.85,25.6 | v119.81,25.48 119.85,25.6 | 120.19,25.48 119.85,25.36 | v119.81,25.48 119.85,25.36 | 141.15,25.48 140.81,25.6 | v140.76,25.48 140.81,25.6 | 141.15,25.48 140.81,25.36 | v140.76,25.48 140.81,25.36 | 151.84,66.24 151.5,66.36 | v151.46,66.24 151.5,66.36 | 151.84,66.24 151.5,66.12 | v151.46,66.24 151.5,66.12 | 151.19,66.51 151.34,66.18 | v151.46,66.24 151.34,66.18 | 151.19,66.51 151.51,66.35 | v151.46,66.24 151.51,66.35 | 179.52,62.55 179.43,62.21 | v179.55,62.17 179.43,62.21 | 179.52,62.55 179.67,62.22 | v179.55,62.17 179.67,62.22 | 174.6,64.98 174.26,65.11 | v174.22,64.99 174.26,65.11 | 174.6,64.98 174.26,64.87 | v174.22,64.99 174.26,64.87 | 77.89,25.48 77.57,25.65 | v77.51,25.53 77.57,25.65 | 77.89,25.48 77.54,25.41 | v77.51,25.53 77.54,25.41 | 77.89,25.48 77.57,25.65 | v77.51,25.53 77.57,25.65
  Top 0.203: 77.89,25.48 77.54,25.41 | v77.51,25.53 77.54,25.41 | 77.89,25.48 77.57,25.65 | v77.51,25.53 77.57,25.65 | 77.89,25.48 77.54,25.41 | v77.51,25.53 77.54,25.41 | 54.36,25.4 54.72,25.37 | v54.73,25.5 54.72,25.37 | 54.36,25.4 54.66,25.6 | v54.73,25.5 54.66,25.6 | 55.11,25.49 54.78,25.61 | v54.73,25.5 54.78,25.61 | 55.11,25.49 54.78,25.38 | v54.73,25.5 54.78,25.38 | 54.36,25.4 54.72,25.37 | v54.73,25.5 54.72,25.37 | 54.36,25.4 54.66,25.6 | v54.73,25.5 54.66,25.6 | 54.36,25.4 54.72,25.37 | v54.73,25.5 54.72,25.37 | 54.36,25.4 54.66,25.6 | v54.73,25.5 54.66,25.6 | 55.11,25.49 54.78,25.61 | v54.73,25.5 54.78,25.61 | 55.11,25.49 54.78,25.38 | v54.73,25.5 54.78,25.38 | 55.11,25.49 54.78,25.61 | v54.73,25.5 54.78,25.61 | 55.11,25.49 54.78,25.38 | v54.73,25.5 54.78,25.38 | 99.23,25.48 98.9,25.62 | v98.85,25.51 98.9,25.62 | 99.23,25.48 98.89,25.39 | v98.85,25.51 98.89,25.39 | 99.23,25.48 98.9,25.62 | v98.85,25.51 98.9,25.62 | 99.23,25.48 98.89,25.39 | v98.85,25.51 98.89,25.39 | 99.23,25.48 98.9,25.62 | v98.85,25.51 98.9,25.62 | 99.23,25.48 98.89,25.39 | v98.85,25.51 98.89,25.39 | 120.19,25.48 119.85,25.6 | v119.81,25.48 119.85,25.6 | 120.19,25.48 119.85,25.36 | v119.81,25.48 119.85,25.36 | 120.19,25.48 119.85,25.6 | v119.81,25.48 119.85,25.6 | 120.19,25.48 119.85,25.36 | v119.81,25.48 119.85,25.36 | 120.19,25.48 119.85,25.6 | v119.81,25.48 119.85,25.6 | 120.19,25.48 119.85,25.36 | v119.81,25.48 119.85,25.36 | 141.15,25.48 140.81,25.6 | v140.76,25.48 140.81,25.6 | 141.15,25.48 140.81,25.36 | v140.76,25.48 140.81,25.36 | 141.15,25.48 140.81,25.6 | v140.76,25.48 140.81,25.6 | 141.15,25.48 140.81,25.36 | v140.76,25.48 140.81,25.36 | 141.15,25.48 140.81,25.6 | v140.76,25.48 140.81,25.6
  Top 0.203: 141.15,25.48 140.81,25.36 | v140.76,25.48 140.81,25.36 | 151.84,66.24 151.5,66.36 | v151.46,66.24 151.5,66.36 | 151.84,66.24 151.5,66.12 | v151.46,66.24 151.5,66.12 | 151.19,66.51 151.34,66.18 | v151.46,66.24 151.34,66.18 | 151.19,66.51 151.51,66.35 | v151.46,66.24 151.51,66.35 | 151.84,66.24 151.5,66.36 | v151.46,66.24 151.5,66.36 | 151.84,66.24 151.5,66.12 | v151.46,66.24 151.5,66.12 | 151.84,66.24 151.5,66.36 | v151.46,66.24 151.5,66.36 | 151.84,66.24 151.5,66.12 | v151.46,66.24 151.5,66.12 | 151.19,66.51 151.34,66.18 | v151.46,66.24 151.34,66.18 | 151.19,66.51 151.51,66.35 | v151.46,66.24 151.51,66.35 | 151.19,66.51 151.34,66.18 | v151.46,66.24 151.34,66.18 | 151.19,66.51 151.51,66.35 | v151.46,66.24 151.51,66.35 | 179.52,62.55 179.43,62.21 | v179.55,62.17 179.43,62.21 | 179.52,62.55 179.67,62.22 | v179.55,62.17 179.67,62.22 | 179.52,62.55 179.43,62.21 | v179.55,62.17 179.43,62.21 | 179.52,62.55 179.67,62.22 | v179.55,62.17 179.67,62.22 | 179.52,62.55 179.43,62.21 | v179.55,62.17 179.43,62.21 | 179.52,62.55 179.67,62.22 | v179.55,62.17 179.67,62.22 | 174.6,64.98 174.26,65.11 | v174.22,64.99 174.26,65.11 | 174.6,64.98 174.26,64.87 | v174.22,64.99 174.26,64.87 | 174.6,64.98 174.26,65.11 | v174.22,64.99 174.26,65.11 | 174.6,64.98 174.26,64.87 | v174.22,64.99 174.26,64.87 | 174.6,64.98 174.26,65.11 | v174.22,64.99 174.26,65.11 | 174.6,64.98 174.26,64.87 | v174.22,64.99 174.26,64.87
  Top 0.406: 47.38,25.4 46.68,25.87 CONN2.19 46.68,24.93 47.38,25.4 | 150.42,79.85 151.22,79.56 JP14.14 151.01,80.47 150.42,79.85
  Route15 0.203: v54.73,25.5 55.45,24.78 76.07,24.78 | 76.07,24.78 76.76,24.78 v77.51,25.53 | v98.85,25.51 98.13,24.78 | 98.13,24.78 76.07,24.78 | v119.81,25.48 119.11,24.78 | 119.11,24.78 98.13,24.78 | v140.76,25.48 140.06,24.78 | 140.06,24.78 119.11,24.78 | CONN3.19 171.7,26.64 165.96,26.64 164.11,24.78 140.06,24.78 | v174.22,64.99 162.38,64.99 161.74,65.63 152.07,65.63 v151.46,66.24 | 77.24,25.26 77.56,25.42 | v77.51,25.53 77.56,25.42 | 77.24,25.26 77.4,25.59 | v77.51,25.53 77.4,25.59 | 55,25.23 54.85,25.55 | v54.73,25.5 54.85,25.55 | 55,25.23 54.68,25.38 | v54.73,25.5 54.68,25.38 | 98.58,25.24 98.91,25.39 | v98.85,25.51 98.91,25.39 | 98.58,25.24 98.74,25.56 | v98.85,25.51 98.74,25.56 | 119.54,25.21 119.86,25.37 | v119.81,25.48 119.86,25.37 | 119.54,25.21 119.69,25.54 | v119.81,25.48 119.69,25.54 | 140.49,25.21 140.82,25.37 | v140.76,25.48 140.82,25.37 | 140.49,25.21 140.65,25.54 | v140.76,25.48 140.65,25.54 | 151.73,65.97 151.57,66.29 | v151.46,66.24 151.57,66.29 | 151.73,65.97 151.4,66.12 | v151.46,66.24 151.4,66.12 | 173.84,64.99 174.17,64.87 | v174.22,64.99 174.17,64.87 | 173.84,64.99 174.17,65.11 | v174.22,64.99 174.17,65.11 | 77.24,25.26 77.56,25.42 | v77.51,25.53 77.56,25.42 | 77.24,25.26 77.4,25.59 | v77.51,25.53 77.4,25.59 | 77.24,25.26 77.56,25.42 | v77.51,25.53 77.56,25.42 | 77.24,25.26 77.4,25.59 | v77.51,25.53 77.4,25.59 | 77.24,25.26 77.56,25.42 | v77.51,25.53 77.56,25.42 | 77.24,25.26 77.4,25.59 | v77.51,25.53 77.4,25.59 | 55,25.23 54.85,25.55 | v54.73,25.5 54.85,25.55 | 55,25.23 54.68,25.38 | v54.73,25.5 54.68,25.38 | 98.58,25.24 98.91,25.39 | v98.85,25.51 98.91,25.39 | 98.58,25.24 98.74,25.56 | v98.85,25.51 98.74,25.56 | 98.58,25.24 98.91,25.39
  Route15 0.203: v98.85,25.51 98.91,25.39 | 98.58,25.24 98.74,25.56 | v98.85,25.51 98.74,25.56 | 98.58,25.24 98.91,25.39 | v98.85,25.51 98.91,25.39 | 98.58,25.24 98.74,25.56 | v98.85,25.51 98.74,25.56 | 119.54,25.21 119.86,25.37 | v119.81,25.48 119.86,25.37 | 119.54,25.21 119.69,25.54 | v119.81,25.48 119.69,25.54 | 119.54,25.21 119.86,25.37 | v119.81,25.48 119.86,25.37 | 119.54,25.21 119.69,25.54 | v119.81,25.48 119.69,25.54 | 119.54,25.21 119.86,25.37 | v119.81,25.48 119.86,25.37 | 119.54,25.21 119.69,25.54 | v119.81,25.48 119.69,25.54 | 140.49,25.21 140.82,25.37 | v140.76,25.48 140.82,25.37 | 140.49,25.21 140.65,25.54 | v140.76,25.48 140.65,25.54 | 140.49,25.21 140.82,25.37 | v140.76,25.48 140.82,25.37 | 140.49,25.21 140.65,25.54 | v140.76,25.48 140.65,25.54 | 140.49,25.21 140.82,25.37 | v140.76,25.48 140.82,25.37 | 140.49,25.21 140.65,25.54 | v140.76,25.48 140.65,25.54 | 151.73,65.97 151.57,66.29 | v151.46,66.24 151.57,66.29 | 151.73,65.97 151.4,66.12 | v151.46,66.24 151.4,66.12 | 151.73,65.97 151.57,66.29 | v151.46,66.24 151.57,66.29 | 151.73,65.97 151.4,66.12 | v151.46,66.24 151.4,66.12 | 151.73,65.97 151.57,66.29 | v151.46,66.24 151.57,66.29 | 151.73,65.97 151.4,66.12 | v151.46,66.24 151.4,66.12 | 173.84,64.99 174.17,64.87 | v174.22,64.99 174.17,64.87 | 173.84,64.99 174.17,65.11 | v174.22,64.99 174.17,65.11 | 173.84,64.99 174.17,64.87 | v174.22,64.99 174.17,64.87 | 173.84,64.99 174.17,65.11 | v174.22,64.99 174.17,65.11 | 173.84,64.99 174.17,64.87 | v174.22,64.99 174.17,64.87 | 173.84,64.99 174.17,65.11 | v174.22,64.99 174.17,65.11
  Route15 0.406: 172.21,26.12 172.39,25.29 CONN3.19 173.05,25.95 172.21,26.12
  Bottom 0.203: v179.55,62.17 179.55,57.83 182.19,55.19 182.19,26.54 181.05,25.39 CONN3.19 | 179.55,61.79 179.67,62.13 | v179.55,62.17 179.67,62.13 | 179.55,61.79 179.43,62.13 | v179.55,62.17 179.43,62.13 | 179.55,61.79 179.67,62.13 | v179.55,62.17 179.67,62.13 | 179.55,61.79 179.43,62.13 | v179.55,62.17 179.43,62.13 | 179.55,61.79 179.67,62.13 | v179.55,62.17 179.67,62.13 | 179.55,61.79 179.43,62.13 | v179.55,62.17 179.43,62.13 | 179.55,61.79 179.67,62.13 | v179.55,62.17 179.67,62.13 | 179.55,61.79 179.43,62.13 | v179.55,62.17 179.43,62.13
  Bottom 0.406: 173.95,25.39 173.24,25.87 CONN3.19 173.24,24.93 173.95,25.39
/RST_EZFET  (via drill 0.25 pad 0.46)
  Top 0.127: U3.64 51.02,88.94 v51.58,89.51 | R2.1 35.74,111.28 34.99,112.03 S1.P$2 | 51.31,89.24 51.64,89.35 | v51.58,89.51 51.64,89.35 | 51.31,89.24 51.43,89.56 | v51.58,89.51 51.43,89.56 | 51.31,89.24 51.64,89.35 | v51.58,89.51 51.64,89.35 | 51.31,89.24 51.43,89.56 | v51.58,89.51 51.43,89.56 | 51.31,89.24 51.64,89.35 | v51.58,89.51 51.64,89.35 | 51.31,89.24 51.43,89.56 | v51.58,89.51 51.43,89.56 | 51.31,89.24 51.64,89.35 | v51.58,89.51 51.64,89.35 | 51.31,89.24 51.43,89.56 | v51.58,89.51 51.43,89.56
  Top 0.203: v50.83,102.89 51.17,103.23 C5.1 | 51.1,103.15 50.78,103 | v50.83,102.89 50.78,103 | 51.1,103.15 50.95,102.83 | v50.83,102.89 50.95,102.83 | 51.1,103.15 50.78,103 | v50.83,102.89 50.78,103 | 51.1,103.15 50.95,102.83 | v50.83,102.89 50.95,102.83 | 51.1,103.15 50.78,103 | v50.83,102.89 50.78,103 | 51.1,103.15 50.95,102.83 | v50.83,102.89 50.95,102.83 | 51.1,103.15 50.78,103 | v50.83,102.89 50.78,103 | 51.1,103.15 50.95,102.83 | v50.83,102.89 50.95,102.83
  Top 0.254: 34.16,112.03 33.88,112.3 S1.P$2 33.88,111.75 34.16,112.03
  Bottom 0.203: v50.83,102.89 50.83,104.61 48.31,107.13 41.63,107.13 37.74,111.02 34.62,111.02 S1.P$2 | JP5.13 68.34,99.27 59,89.94 53.46,89.94 53.04,89.51 v51.58,89.51 | v50.83,102.89 48.56,100.61 48.56,96.56 47.14,95.14 47.14,90.34 48.21,89.27 48.97,89.27 49.2,89.51 v51.58,89.51 | 50.83,103.27 50.71,102.93 | v50.83,102.89 50.71,102.93 | 50.83,103.27 50.95,102.93 | v50.83,102.89 50.95,102.93 | 50.56,102.61 50.89,102.77 | v50.83,102.89 50.89,102.77 | 50.56,102.61 50.72,102.94 | v50.83,102.89 50.72,102.94 | 51.96,89.51 51.62,89.63 | v51.58,89.51 51.62,89.63 | 51.96,89.51 51.62,89.39 | v51.58,89.51 51.62,89.39 | 51.2,89.51 51.54,89.39 | v51.58,89.51 51.54,89.39 | 51.2,89.51 51.54,89.63 | v51.58,89.51 51.54,89.63 | 50.83,103.27 50.71,102.93 | v50.83,102.89 50.71,102.93 | 50.83,103.27 50.95,102.93 | v50.83,102.89 50.95,102.93 | 50.56,102.61 50.89,102.77 | v50.83,102.89 50.89,102.77 | 50.56,102.61 50.72,102.94 | v50.83,102.89 50.72,102.94 | 50.83,103.27 50.71,102.93 | v50.83,102.89 50.71,102.93 | 50.83,103.27 50.95,102.93 | v50.83,102.89 50.95,102.93 | 50.83,103.27 50.71,102.93 | v50.83,102.89 50.71,102.93 | 50.83,103.27 50.95,102.93 | v50.83,102.89 50.95,102.93 | 50.56,102.61 50.89,102.77 | v50.83,102.89 50.89,102.77 | 50.56,102.61 50.72,102.94 | v50.83,102.89 50.72,102.94 | 50.56,102.61 50.89,102.77 | v50.83,102.89 50.89,102.77 | 50.56,102.61 50.72,102.94 | v50.83,102.89 50.72,102.94 | 51.96,89.51 51.62,89.63 | v51.58,89.51 51.62,89.63 | 51.96,89.51 51.62,89.39 | v51.58,89.51 51.62,89.39 | 51.2,89.51 51.54,89.39 | v51.58,89.51 51.54,89.39 | 51.2,89.51 51.54,89.63 | v51.58,89.51 51.54,89.63 | 51.96,89.51 51.62,89.63 | v51.58,89.51 51.62,89.63 | 51.96,89.51 51.62,89.39
  Bottom 0.203: v51.58,89.51 51.62,89.39 | 51.96,89.51 51.62,89.63 | v51.58,89.51 51.62,89.63 | 51.96,89.51 51.62,89.39 | v51.58,89.51 51.62,89.39 | 51.2,89.51 51.54,89.39 | v51.58,89.51 51.54,89.39 | 51.2,89.51 51.54,89.63 | v51.58,89.51 51.54,89.63 | 51.2,89.51 51.54,89.39 | v51.58,89.51 51.54,89.39 | 51.2,89.51 51.54,89.63 | v51.58,89.51 51.54,89.63
  Bottom 0.406: 34,111.64 33.91,112.08 S1.P$2 33.55,111.73 34,111.64 | 68.25,99.19 69,98.78 JP5.13 68.92,99.71 68.25,99.19
D+
  Top 0.152: R9.1 32.59,100.54 25.81,100.54 21.91,96.64 14.77,96.64 14.74,96.64 13.89,97.48 13.89,98.48 U2.1
  Top 0.203: U2.1
  Top 0.305: U2.1 12.08,101.01 EZUSB.3
D-
  Top 0.152: 14.88,101.13 15.69,101.94 24.14,101.94 26.29,104.1 R8.1
  Top 0.305: 8.94,101.83 EZUSB.2 8.96,101.86 9,101.89 14.24,101.89 14.88,101.26 14.88,101.13 U2.4
GND  (via drill 0.25 pad 0.46)  (1 unrouted)
  Top 0.203: TP10.P$1 146.42,5.3 v149.08,5.3 | C32.1 58.57,30.46 U$8.P$17 | U$2.P$17 80.76,30.55 | C28.1 74.92,30.25 | U$4.P$17 97.37,30.64 C29.1 97.24,30.6 v95.35,30.6 | U$5.P$17 117.76,30.56 C30.1 117.55,30.6 v115.8,30.6 | v138.12,30.53 140.22,30.53 C31.1 140.31,30.56 U$6.P$17 | U$6.P$2 148.63,15.28 v151.99,15.28 | U$4.P$2 105.8,15.28 v109.17,15.28 | U$5.P$2 127.12,15.28 v130.55,15.28 | 87.48,15.32 U$2.P$2 | TP6.P$1 62.22,5.28 | TP9.P$1 127.12,5.25 | RADIO_CONN.P$5 v57.8,60.47 | U4.49 104.24,83.93 v104.24,84.73 | 109.12,112.61 C36.2 | 95.97,76.66 v94.95,76.66 | 48.91,96.44 47.8,97.56 R7.2 | v42.83,91.74 43.35,92.26 Q2.2 | 43.1,92.01 42.78,91.86 | v42.83,91.74 42.78,91.86 | 43.1,92.01 42.95,91.69 | v42.83,91.74 42.95,91.69 | 148.7,5.3 149.04,5.18 | v149.08,5.3 149.04,5.18 | 148.7,5.3 149.04,5.41 | v149.08,5.3 149.04,5.41 | 95.73,30.6 95.39,30.72 | v95.35,30.6 95.39,30.72 | 95.73,30.6 95.39,30.48 | v95.35,30.6 95.39,30.48 | 116.18,30.6 115.84,30.72 | v115.8,30.6 115.84,30.72 | 116.18,30.6 115.84,30.48 | v115.8,30.6 115.84,30.48 | 138.5,30.53 138.16,30.64 | v138.12,30.53 138.16,30.64 | 138.5,30.53 138.16,30.41 | v138.12,30.53 138.16,30.41 | 87.12,15.32 87.45,15.19 | v87.5,15.31 87.45,15.19 | 87.12,15.32 87.46,15.43 | v87.5,15.31 87.46,15.43 | 108.78,15.28 109.12,15.16 | v109.17,15.28 109.12,15.16 | 108.78,15.28 109.12,15.4 | v109.17,15.28 109.12,15.4 | 130.17,15.28 130.51,15.16 | v130.55,15.28 130.51,15.16 | 130.17,15.28 130.51,15.4 | v130.55,15.28 130.51,15.4 | 151.61,15.28 151.95,15.16 | v151.99,15.28 151.95,15.16 | 151.61,15.28 151.95,15.4 | v151.99,15.28 151.95,15.4 | 57.41,60.47 57.75,60.35 | v57.8,60.47 57.75,60.35 | 57.41,60.47 57.75,60.59 | v57.8,60.47 57.75,60.59
  Top 0.203: 104.24,84.35 104.36,84.69 | v104.24,84.73 104.36,84.69 | 104.24,84.35 104.12,84.69 | v104.24,84.73 104.12,84.69 | 95.33,76.66 94.99,76.78 | v94.95,76.66 94.99,76.78 | 95.33,76.66 94.99,76.54 | v94.95,76.66 94.99,76.54 | 43.1,92.01 42.78,91.86 | v42.83,91.74 42.78,91.86 | 43.1,92.01 42.95,91.69 | v42.83,91.74 42.95,91.69 | 43.1,92.01 42.78,91.86 | v42.83,91.74 42.78,91.86 | 43.1,92.01 42.95,91.69 | v42.83,91.74 42.95,91.69 | 43.1,92.01 42.78,91.86 | v42.83,91.74 42.78,91.86 | 43.1,92.01 42.95,91.69 | v42.83,91.74 42.95,91.69 | 148.7,5.3 149.04,5.18 | v149.08,5.3 149.04,5.18 | 148.7,5.3 149.04,5.41 | v149.08,5.3 149.04,5.41 | 148.7,5.3 149.04,5.18 | v149.08,5.3 149.04,5.18 | 148.7,5.3 149.04,5.41 | v149.08,5.3 149.04,5.41 | 148.7,5.3 149.04,5.18 | v149.08,5.3 149.04,5.18 | 148.7,5.3 149.04,5.41 | v149.08,5.3 149.04,5.41 | 95.73,30.6 95.39,30.72 | v95.35,30.6 95.39,30.72 | 95.73,30.6 95.39,30.48 | v95.35,30.6 95.39,30.48 | 95.73,30.6 95.39,30.72 | v95.35,30.6 95.39,30.72 | 95.73,30.6 95.39,30.48 | v95.35,30.6 95.39,30.48 | 95.73,30.6 95.39,30.72 | v95.35,30.6 95.39,30.72 | 95.73,30.6 95.39,30.48 | v95.35,30.6 95.39,30.48 | 116.18,30.6 115.84,30.72 | v115.8,30.6 115.84,30.72 | 116.18,30.6 115.84,30.48 | v115.8,30.6 115.84,30.48 | 116.18,30.6 115.84,30.72 | v115.8,30.6 115.84,30.72 | 116.18,30.6 115.84,30.48 | v115.8,30.6 115.84,30.48 | 116.18,30.6 115.84,30.72 | v115.8,30.6 115.84,30.72 | 116.18,30.6 115.84,30.48 | v115.8,30.6 115.84,30.48 | 138.5,30.53 138.16,30.64 | v138.12,30.53 138.16,30.64 | 138.5,30.53 138.16,30.41 | v138.12,30.53 138.16,30.41 | 138.5,30.53 138.16,30.64 | v138.12,30.53 138.16,30.64 | 138.5,30.53 138.16,30.41 | v138.12,30.53 138.16,30.41 | 138.5,30.53 138.16,30.64
  Top 0.203: v138.12,30.53 138.16,30.64 | 138.5,30.53 138.16,30.41 | v138.12,30.53 138.16,30.41 | 87.12,15.32 87.45,15.19 | v87.5,15.31 87.45,15.19 | 87.12,15.32 87.46,15.43 | v87.5,15.31 87.46,15.43 | 87.12,15.32 87.45,15.19 | v87.5,15.31 87.45,15.19 | 87.12,15.32 87.46,15.43 | v87.5,15.31 87.46,15.43 | 87.12,15.32 87.45,15.19 | v87.5,15.31 87.45,15.19 | 87.12,15.32 87.46,15.43 | v87.5,15.31 87.46,15.43 | 108.78,15.28 109.12,15.16 | v109.17,15.28 109.12,15.16 | 108.78,15.28 109.12,15.4 | v109.17,15.28 109.12,15.4 | 108.78,15.28 109.12,15.16 | v109.17,15.28 109.12,15.16 | 108.78,15.28 109.12,15.4 | v109.17,15.28 109.12,15.4 | 108.78,15.28 109.12,15.16 | v109.17,15.28 109.12,15.16 | 108.78,15.28 109.12,15.4 | v109.17,15.28 109.12,15.4 | 130.17,15.28 130.51,15.16 | v130.55,15.28 130.51,15.16 | 130.17,15.28 130.51,15.4 | v130.55,15.28 130.51,15.4 | 130.17,15.28 130.51,15.16 | v130.55,15.28 130.51,15.16 | 130.17,15.28 130.51,15.4 | v130.55,15.28 130.51,15.4 | 130.17,15.28 130.51,15.16 | v130.55,15.28 130.51,15.16 | 130.17,15.28 130.51,15.4 | v130.55,15.28 130.51,15.4 | 151.61,15.28 151.95,15.16 | v151.99,15.28 151.95,15.16 | 151.61,15.28 151.95,15.4 | v151.99,15.28 151.95,15.4 | 151.61,15.28 151.95,15.16 | v151.99,15.28 151.95,15.16 | 151.61,15.28 151.95,15.4 | v151.99,15.28 151.95,15.4 | 151.61,15.28 151.95,15.16 | v151.99,15.28 151.95,15.16 | 151.61,15.28 151.95,15.4 | v151.99,15.28 151.95,15.4 | 57.41,60.47 57.75,60.35 | v57.8,60.47 57.75,60.35 | 57.41,60.47 57.75,60.59 | v57.8,60.47 57.75,60.59 | 57.41,60.47 57.75,60.35 | v57.8,60.47 57.75,60.35 | 57.41,60.47 57.75,60.59 | v57.8,60.47 57.75,60.59 | 57.41,60.47 57.75,60.35 | v57.8,60.47 57.75,60.35 | 57.41,60.47 57.75,60.59
  Top 0.203: v57.8,60.47 57.75,60.59 | 104.24,84.35 104.36,84.69 | v104.24,84.73 104.36,84.69 | 104.24,84.35 104.12,84.69 | v104.24,84.73 104.12,84.69 | 104.24,84.35 104.36,84.69 | v104.24,84.73 104.36,84.69 | 104.24,84.35 104.12,84.69 | v104.24,84.73 104.12,84.69 | 104.36,84.69 104.24,84.35 104.12,84.69 | v104.24,84.73 104.36,84.69 | v104.24,84.73 104.12,84.69 | 95.33,76.66 94.99,76.78 | v94.95,76.66 94.99,76.78 | 95.33,76.66 94.99,76.54 | v94.95,76.66 94.99,76.54 | 95.33,76.66 94.99,76.78 | v94.95,76.66 94.99,76.78 | 95.33,76.66 94.99,76.54 | v94.95,76.66 94.99,76.54 | 95.33,76.66 94.99,76.78 | v94.95,76.66 94.99,76.78 | 95.33,76.66 94.99,76.54 | v94.95,76.66 94.99,76.54
  Top 0.25: 103.78,78.65 U4.39 | 104.13,78.65 103.78,78.78 | v103.75,78.68 103.78,78.78 | 104.13,78.65 103.77,78.58 | v103.75,78.68 103.77,78.58 | 104.13,78.65 103.78,78.78 | v103.75,78.68 103.78,78.78 | 104.13,78.65 103.77,78.58 | v103.75,78.68 103.77,78.58 | 104.13,78.65 103.78,78.78 | v103.75,78.68 103.78,78.78 | 104.13,78.65 103.77,78.58 | v103.75,78.68 103.77,78.58 | 104.13,78.65 103.78,78.78 | v103.75,78.68 103.78,78.78 | 104.13,78.65 103.77,78.58 | v103.75,78.68 103.77,78.58
  Top 0.254: U4.56 100.69,82.65 v101.65,82.65 | 57.99,86.05 U3.16 57.99,87.71 57.81,87.53 57.1,87.53 56.99,87.64 U3.14 57,88.89 56.53,89.36 v56.47,89.36 | U4.16 95.96,74.61 v95.57,74.61 | 95.97,76.66 U4.14 | v56.47,89.36 56.47,90.74 56.41,90.8 56.14,90.8 U3.TP | U3.56 | 48.91,96.44 49.83,96.44 U3.49 | U3.56 | 52.54,92.94 52.53,92.94 U3.56 | v101.65,82.65 102.19,82.65 U4.53 | 101.27,82.65 101.62,82.55 | v101.65,82.65 101.62,82.55 | 101.27,82.65 101.62,82.74 | v101.65,82.65 101.62,82.74 | 102.03,82.65 101.67,82.74 | v101.65,82.65 101.67,82.74 | 102.03,82.65 101.67,82.55 | v101.65,82.65 101.67,82.55 | 95.95,74.61 95.6,74.71 | v95.57,74.61 95.6,74.71 | 95.95,74.61 95.6,74.51 | v95.57,74.61 95.6,74.51 | 56.77,89.12 56.56,89.42 | v56.47,89.36 56.56,89.42 | 56.77,89.12 56.43,89.27 | v56.47,89.36 56.43,89.27 | 56.47,89.74 56.37,89.39 | v56.47,89.36 56.37,89.39 | 56.47,89.74 56.57,89.39 | v56.47,89.36 56.57,89.39 | 101.27,82.65 101.62,82.55 | v101.65,82.65 101.62,82.55 | 101.27,82.65 101.62,82.74 | v101.65,82.65 101.62,82.74 | 102.03,82.65 101.67,82.74 | v101.65,82.65 101.67,82.74 | 102.03,82.65 101.67,82.55 | v101.65,82.65 101.67,82.55 | 101.27,82.65 101.62,82.55 | v101.65,82.65 101.62,82.55 | 101.27,82.65 101.62,82.74 | v101.65,82.65 101.62,82.74 | 101.27,82.65 101.62,82.55 | v101.65,82.65 101.62,82.55 | 101.27,82.65 101.62,82.74 | v101.65,82.65 101.62,82.74 | 102.03,82.65 101.67,82.74 | v101.65,82.65 101.67,82.74 | 102.03,82.65 101.67,82.55 | v101.65,82.65 101.67,82.55 | 102.03,82.65 101.67,82.74 | v101.65,82.65 101.67,82.74 | 102.03,82.65 101.67,82.55 | v101.65,82.65 101.67,82.55 | 95.95,74.61 95.6,74.71 | v95.57,74.61 95.6,74.71 | 95.95,74.61 95.6,74.51 | v95.57,74.61 95.6,74.51
  Top 0.254: 95.95,74.61 95.6,74.71 | v95.57,74.61 95.6,74.71 | 95.95,74.61 95.6,74.51 | v95.57,74.61 95.6,74.51 | 95.95,74.61 95.6,74.71 | v95.57,74.61 95.6,74.71 | 95.95,74.61 95.6,74.51 | v95.57,74.61 95.6,74.51 | 56.77,89.12 56.56,89.42 | v56.47,89.36 56.56,89.42 | 56.77,89.12 56.43,89.27 | v56.47,89.36 56.43,89.27 | 56.47,89.74 56.37,89.39 | v56.47,89.36 56.37,89.39 | 56.47,89.74 56.57,89.39 | v56.47,89.36 56.57,89.39 | 56.77,89.12 56.56,89.42 | v56.47,89.36 56.56,89.42 | 56.77,89.12 56.43,89.27 | v56.47,89.36 56.43,89.27 | 56.77,89.12 56.56,89.42 | v56.47,89.36 56.56,89.42 | 56.77,89.12 56.43,89.27 | v56.47,89.36 56.43,89.27 | 56.47,89.74 56.37,89.39 | v56.47,89.36 56.37,89.39 | 56.47,89.74 56.57,89.39 | v56.47,89.36 56.57,89.39 | 56.47,89.74 56.37,89.39 | v56.47,89.36 56.37,89.39 | 56.47,89.74 56.57,89.39 | v56.47,89.36 56.57,89.39
  Top 0.305: C24.2 89.38,80.77 v88.24,80.77 | v88.62,74.44 C23.2 | 92.38,70.19 C20.2 | C19.2 110.11,77.75 v110.11,76.67 | v65.61,15.34 64.89,15.32 U$8.P$2 | 57.99,86.05 C10.1 | U$9.P$17 24.91,36 v24.91,38.77 | 9.76,29.69 U$9.P$2 | R21.2 14.59,88.96 v14.59,87.83 | LED3.C 18.21,87.84 v19.05,87.84 | C13.2 37.41,104.08 v38.83,104.08 | v39.02,100.47 38.91,100.58 C14.2 | U2.3 16.21,98.5 16.55,98.84 16.55,100.2 v16.87,100.51 | U3.TP 54.99,92.69 U3.39 | 52.54,92.94 54.99,92.94 v54.99,95.91 | 110.11,77.06 110.03,76.69 | v110.11,76.67 110.03,76.69 | 110.11,77.06 110.18,76.69 | v110.11,76.67 110.18,76.69 | 92.01,70.19 92.38,70.12 | v92.39,70.2 92.38,70.12 | 92.01,70.19 92.37,70.27 | v92.39,70.2 92.37,70.27 | 89,74.44 88.63,74.52 | v88.62,74.44 88.63,74.52 | 89,74.44 88.63,74.37 | v88.62,74.44 88.63,74.37 | 88.62,80.77 88.26,80.84 | v88.24,80.77 88.26,80.84 | 88.62,80.77 88.26,80.69 | v88.24,80.77 88.26,80.69 | 54.99,95.52 55.07,95.89 | v54.99,95.91 55.07,95.89 | 54.99,95.52 54.92,95.89 | v54.99,95.91 54.92,95.89 | 65.22,15.33 65.59,15.26 | v65.61,15.34 65.59,15.26 | 65.22,15.33 65.59,15.41 | v65.61,15.34 65.59,15.41 | 24.91,38.39 24.98,38.76 | v24.91,38.77 24.98,38.76 | 24.91,38.39 24.84,38.76 | v24.91,38.77 24.84,38.76 | 9.76,30.04 9.65,29.68 | v9.73,29.66 9.65,29.68 | 9.76,30.04 9.8,29.66 | v9.73,29.66 9.8,29.66 | 14.59,88.21 14.51,87.84 | v14.59,87.83 14.51,87.84 | 14.59,88.21 14.66,87.84 | v14.59,87.83 14.66,87.84 | 18.67,87.84 19.04,87.77 | v19.05,87.84 19.04,87.77 | 18.67,87.84 19.04,87.91 | v19.05,87.84 19.04,87.91 | 16.6,100.24 16.91,100.45 | v16.87,100.51 16.91,100.45 | 16.6,100.24 16.8,100.55 | v16.87,100.51 16.8,100.55 | 38.66,100.58 38.98,100.4 | v39.02,100.47 38.98,100.4
  Top 0.305: 38.66,100.58 39.03,100.55 | v39.02,100.47 39.03,100.55 | 38.45,104.08 38.81,104 | v38.83,104.08 38.81,104 | 38.45,104.08 38.81,104.15 | v38.83,104.08 38.81,104.15 | 110.11,77.06 110.03,76.69 | v110.11,76.67 110.03,76.69 | 110.11,77.06 110.18,76.69 | v110.11,76.67 110.18,76.69 | 110.11,77.06 110.03,76.69 | v110.11,76.67 110.03,76.69 | 110.11,77.06 110.18,76.69 | v110.11,76.67 110.18,76.69 | 110.11,77.06 110.03,76.69 | v110.11,76.67 110.03,76.69 | 110.11,77.06 110.18,76.69 | v110.11,76.67 110.18,76.69 | 92.01,70.19 92.38,70.12 | v92.39,70.2 92.38,70.12 | 92.01,70.19 92.37,70.27 | v92.39,70.2 92.37,70.27 | 92.01,70.19 92.38,70.12 | v92.39,70.2 92.38,70.12 | 92.01,70.19 92.37,70.27 | v92.39,70.2 92.37,70.27 | 92.01,70.19 92.38,70.12 | v92.39,70.2 92.38,70.12 | 92.01,70.19 92.37,70.27 | v92.39,70.2 92.37,70.27 | 89,74.44 88.63,74.52 | v88.62,74.44 88.63,74.52 | 89,74.44 88.63,74.37 | v88.62,74.44 88.63,74.37 | 89,74.44 88.63,74.52 | v88.62,74.44 88.63,74.52 | 89,74.44 88.63,74.37 | v88.62,74.44 88.63,74.37 | 89,74.44 88.63,74.52 | v88.62,74.44 88.63,74.52 | 89,74.44 88.63,74.37 | v88.62,74.44 88.63,74.37 | 88.62,80.77 88.26,80.84 | v88.24,80.77 88.26,80.84 | 88.62,80.77 88.26,80.69 | v88.24,80.77 88.26,80.69 | 88.62,80.77 88.26,80.84 | v88.24,80.77 88.26,80.84 | 88.62,80.77 88.26,80.69 | v88.24,80.77 88.26,80.69 | 88.62,80.77 88.26,80.84 | v88.24,80.77 88.26,80.84 | 88.62,80.77 88.26,80.69 | v88.24,80.77 88.26,80.69 | 54.99,95.52 55.07,95.89 | v54.99,95.91 55.07,95.89 | 54.99,95.52 54.92,95.89 | v54.99,95.91 54.92,95.89 | 54.99,95.52 55.07,95.89 | v54.99,95.91 55.07,95.89 | 54.99,95.52 54.92,95.89 | v54.99,95.91 54.92,95.89 | 54.99,95.52 55.07,95.89 | v54.99,95.91 55.07,95.89
  Top 0.305: 54.99,95.52 54.92,95.89 | v54.99,95.91 54.92,95.89 | 65.22,15.33 65.59,15.26 | v65.61,15.34 65.59,15.26 | 65.22,15.33 65.59,15.41 | v65.61,15.34 65.59,15.41 | 65.22,15.33 65.59,15.26 | v65.61,15.34 65.59,15.26 | 65.22,15.33 65.59,15.41 | v65.61,15.34 65.59,15.41 | 65.22,15.33 65.59,15.26 | v65.61,15.34 65.59,15.26 | 65.22,15.33 65.59,15.41 | v65.61,15.34 65.59,15.41 | 24.91,38.39 24.98,38.76 | v24.91,38.77 24.98,38.76 | 24.91,38.39 24.84,38.76 | v24.91,38.77 24.84,38.76 | 24.91,38.39 24.98,38.76 | v24.91,38.77 24.98,38.76 | 24.91,38.39 24.84,38.76 | v24.91,38.77 24.84,38.76 | 24.91,38.39 24.98,38.76 | v24.91,38.77 24.98,38.76 | 24.91,38.39 24.84,38.76 | v24.91,38.77 24.84,38.76 | 9.76,30.04 9.65,29.68 | v9.73,29.66 9.65,29.68 | 9.76,30.04 9.8,29.66 | v9.73,29.66 9.8,29.66 | 9.76,30.04 9.65,29.68 | v9.73,29.66 9.65,29.68 | 9.76,30.04 9.8,29.66 | v9.73,29.66 9.8,29.66 | 9.76,30.04 9.65,29.68 | v9.73,29.66 9.65,29.68 | 9.76,30.04 9.8,29.66 | v9.73,29.66 9.8,29.66 | 14.59,88.21 14.51,87.84 | v14.59,87.83 14.51,87.84 | 14.59,88.21 14.66,87.84 | v14.59,87.83 14.66,87.84 | 14.59,88.21 14.51,87.84 | v14.59,87.83 14.51,87.84 | 14.59,88.21 14.66,87.84 | v14.59,87.83 14.66,87.84 | 14.59,88.21 14.51,87.84 | v14.59,87.83 14.51,87.84 | 14.59,88.21 14.66,87.84 | v14.59,87.83 14.66,87.84 | 18.67,87.84 19.04,87.77 | v19.05,87.84 19.04,87.77 | 18.67,87.84 19.04,87.91 | v19.05,87.84 19.04,87.91 | 18.67,87.84 19.04,87.77 | v19.05,87.84 19.04,87.77 | 18.67,87.84 19.04,87.91 | v19.05,87.84 19.04,87.91 | 18.67,87.84 19.04,87.77 | v19.05,87.84 19.04,87.77 | 18.67,87.84 19.04,87.91 | v19.05,87.84 19.04,87.91 | 16.6,100.24 16.91,100.45 | v16.87,100.51 16.91,100.45 | 16.6,100.24 16.8,100.55 | v16.87,100.51 16.8,100.55
  Top 0.305: 16.6,100.24 16.91,100.45 | v16.87,100.51 16.91,100.45 | 16.6,100.24 16.8,100.55 | v16.87,100.51 16.8,100.55 | 16.6,100.24 16.91,100.45 | v16.87,100.51 16.91,100.45 | 16.6,100.24 16.8,100.55 | v16.87,100.51 16.8,100.55 | 38.66,100.58 38.98,100.4 | v39.02,100.47 38.98,100.4 | 38.66,100.58 39.03,100.55 | v39.02,100.47 39.03,100.55 | 38.66,100.58 38.98,100.4 | v39.02,100.47 38.98,100.4 | 38.66,100.58 39.03,100.55 | v39.02,100.47 39.03,100.55 | 38.66,100.58 38.98,100.4 | v39.02,100.47 38.98,100.4 | 38.66,100.58 39.03,100.55 | v39.02,100.47 39.03,100.55 | 38.45,104.08 38.81,104 | v38.83,104.08 38.81,104 | 38.45,104.08 38.81,104.15 | v38.83,104.08 38.81,104.15 | 38.45,104.08 38.81,104 | v38.83,104.08 38.81,104 | 38.45,104.08 38.81,104.15 | v38.83,104.08 38.81,104.15 | 38.45,104.08 38.81,104 | v38.83,104.08 38.81,104 | 38.45,104.08 38.81,104.15 | v38.83,104.08 38.81,104.15 | 148.59,15.26
  Top 0.381: EZUSB.5 10.36,99.41 10.36,98.98 10.13,98.75 v9.71,98.75 | v9.97,6.13 9.93,6.09 9.59,6.09 TP5.P$1 | U$7.P$17 152.53,71.38 151.87,72.04 151.87,74.31 | v105.75,6.66 TP8.P$1 | C21.1 88.62,74.53 v88.62,74.44 | C21.1 v85.94,78.32 | C21.1 | v84.82,6.27 84.77,6.22 84.26,6.22 TP7.P$1 | v16.83,103.45 10,110.28 TP1.P$1 | 17.18,103.45 17.28,103.35 C4.2 | C3.2 17.27,100.49 17.26,100.51 v16.87,100.51 | TP4.P$1 7.83,75.69 7.46,75.32 JP10.3 | U4.65 102.87,79.41 103.6,78.68 v103.75,78.68 | TP11.P$1 171.75,52.83 172.59,52 JP19.1 | 148.59,15.26 U$6.P$2 | C17.2 100.1,108.33 | R7.2 47.05,97.46 v47.05,98.52 | C26.1 146.98,40.94 v145.62,40.94 | v94.02,74.15 94.02,73.18 94.04,73.12 94.09,73.07 C18.2 | LED1.C v69.29,86.19 | LED2.C 68.48,91.5 v69.4,91.5 | C12.1 v49.66,100.44 | 54.03,103.12 54.01,103.18 53.97,103.22 C5.2 53.94,103.21 v55.3,103.21 | C22.2 81.08,77.2 v81.08,78.39 | C9.1 58.07,76.52 v59.27,76.52 | C10.1 C2.2 61.16,86.05 v61.2,86.01 | C6.2 49.52,81.2 v50.47,80.26 51.58,80.26 C7.1 51.63,80.21 51.63,82.91 C8.1 | R6.2 50.6,76.5 | C11.1 58.06,82.11 | v38.71,97.52 38.71,96.33 C16.2 | v38.89,89.52 38.89,90.82 C15.2 | C37.2 33.04,90.85 C25.2 35.79,89.4 35.81,89.37 | 58.49,30.39 58.57,30.4 58.63,30.45 58.66,30.52 U$8.P$17 | 53.02,30.44 C32.1 | U1.2 v28.11,95.67 | U$10.P$1 176.59,61.86 v174.06,61.86 | JP10.3 5.91,75.79 6.6,75.32 5.91,74.85 JP10.3 | JP19.1 172.12,49.8 172.59,50.49 173.06,49.8 JP19.1
  Top 0.406: C1.2 23.71,93.66 v23.71,94.36 | 84.88,15.13 U$2.P$2 | R3.1 48.65,76.32 | 100.1,108.33 99.91,108.14 v98.73,108.14 | U4.65 101.65,79.41 v101.65,82.65 | v150.95,74.31 151.87,74.31 C33.1 | R16.2 103.73,89.28 103.73,89.3
  Top 0.508: 103.22,89.3 103.73,89.3 v104.23,89.3
  Top 0.61: 80.76,30.55 C28.1 | 62.22,5.28 v64.64,5.28 | 127.12,5.25 v129.54,5.25
  Route2 0.381: 9.97,29.66 v9.73,29.66 | JP8.14 JP8.12 | JP10.3 5.58,69.09 JP8.14 | v14.59,87.83 5.58,78.83 JP10.4 | JP8.4 JP8.2 | JP8.6 JP8.4 | JP8.8 JP8.6 | JP8.10 JP8.8 | JP8.12 JP8.10 | JP10.4 JP10.3 | JP10.2 JP10.1 | JP10.1 2.57,75.64 3.04,76.34 3.52,75.64 JP10.1 | JP10.3 6.06,75 5.58,74.31 5.11,75 JP10.3 | JP10.3 5.11,75.64 5.58,76.34 6.06,75.64 JP10.3 | JP10.4 5.13,78.21 5.64,78.88 6.07,78.16 JP10.4 | JP10.4 6.06,77.54 5.58,76.84 5.11,77.54 JP10.4 | JP10.2 3.52,77.54 3.04,76.84 2.57,77.54 JP10.2 | JP8.2 4.63,53.69 5.1,54.38 5.57,53.69 JP8.2 | JP8.14 5.57,68.29 5.1,67.59 4.63,68.29 JP8.14 | JP8.14 4.84,69.12 5.58,69.5 5.67,68.66 JP8.14 | JP8.12 4.63,66.39 5.1,67.08 5.57,66.39 JP8.12 | JP8.12 5.57,65.75 5.1,65.05 4.63,65.75 JP8.12 | JP8.10 5.57,63.21 5.1,62.51 4.63,63.21 JP8.10 | JP8.10 4.63,63.85 5.1,64.54 5.57,63.85 JP8.10 | JP8.8 5.57,60.67 5.1,59.97 4.63,60.67 JP8.8 | JP8.8 4.63,61.31 5.1,62 5.57,61.31 JP8.8 | JP8.6 5.57,58.13 5.1,57.43 4.63,58.13 JP8.6 | JP8.6 4.63,58.77 5.1,59.46 5.57,58.77 JP8.6 | JP8.4 5.57,55.59 5.1,54.89 4.63,55.59 JP8.4 | JP8.4 4.63,56.23 5.1,56.92 5.57,56.23 JP8.4
  Route15 0.381: 92.39,72.52 v92.39,70.2 | v94.02,74.15 92.39,72.52 | v88.62,74.44 90.46,74.44 92.39,72.52 | JP10.4 JP10.2 | JP10.4 5.26,77.39 4.57,77.86 5.26,78.33 JP10.4 | JP10.2 3.37,78.33 4.06,77.86 3.37,77.39 JP10.2
  other vias: 58.05,82.12 50.59,76.51 35.83,89.36 73.78,31.24 51.66,44.34 48.63,76.3 160.73,56.13
  pour Top (isolate 0.381, rank 2): 0.14,117.98 185.51,117.98 185.51,-0.29 0.24,-0.29 0.24,117.91
  pour Bottom (isolate 0.381): 0.16,117.98 185.53,117.98 185.53,-0.29 0.26,-0.29 0.26,117.91
JTAG_PWR
  Route2 0.813: TI_JTAG.2 180.16,105.05 181.51,106.39 181.51,109.39 173.68,117.21 69.21,117.21 64.61,112.62 64.61,99.33 67.41,96.54 67.41,83.66 62.25,78.5 43.1,78.5 39.82,81.78 32.32,81.78 JP1.1
JTAG_SENSE
  Route2 0.305: 154.76,102.48 154.76,110.71 149.2,116.27 85.66,116.27 JP12.1 | 154.76,102.48 148.87,96.6 JP14.1 | 154.76,102.48 154.79,102.51 172.82,102.51 TI_JTAG.4 | TI_JTAG.4 175.45,104.49 174.68,104.37 174.8,105.14 TI_JTAG.4 | JP14.1 148.39,95.69 148.87,96.34 149.36,95.69 JP14.1 | JP12.1 83.87,115.17 84.67,115.28 84.56,114.48 JP12.1
  Route2 0.406: JP5.2 83.96,114.51 JP12.1 | JP12.1 83.67,114.08 82.94,114.51 83.62,115.02 JP12.1 | JP5.2 72.11,114.98 72.82,114.51 72.11,114.05 JP5.2
LDO_VDD  (via drill 0.25 pad 0.46)
  Top 0.381: 29,94.3 U1.5 31.07,92.34 C37.1 33.07,92.37 C25.1
  Top 0.406: 29,94.3 v29,93.21
  Top 0.813: R22.2 28.24,86.78 v28.24,88.28 | TP2\.P$1 24.46,116.1 v24.46,114.67
  Route2 0.406: JP11.1 21.34,114.67 v24.46,114.67 | JP11.1 JP11.2 | JP11.2 30.38,101.52 30.38,95.24 29,93.87 v29,93.21 | JP11.4 JP11.3 | JP11.3 JP11.1 | JP11.1 20.44,114.43 21.27,114.6 21.09,113.77 JP11.1 | JP11.1 21.01,113.58 20.55,112.87 20.08,113.58 JP11.1 | JP11.1 20.24,113.42 19.53,113.89 20.24,114.35 JP11.1 | JP11.3 18.47,113.58 18.01,112.87 17.54,113.58 JP11.3 | JP11.3 18.32,114.35 19.02,113.89 18.32,113.42 JP11.3 | JP11.4 17.54,111.65 18.01,112.36 18.47,111.65 JP11.4 | JP11.2 20.08,111.65 20.55,112.36 21.01,111.65 JP11.2 | JP11.2 21.09,111.46 21.27,110.63 20.44,110.8 JP11.2
  Route2 0.813: JP1.3 28.24,80.24 v28.24,88.28 29,89.05 v29,93.21
  pour Route15 (isolate 0.381): 18.78,105.03 43.85,105.03 43.92,71.92 18.86,71.92 18.8,105.03
LED1_EZFET  (via drill 0.25 pad 0.46)  (1 unrouted)
  Top 0.127: U3.20 60.47,90.44 62.36,88.56 R10.2